# EAGLE board Interface v1_6 (EAGLE 7.7.0), part 1 of 2
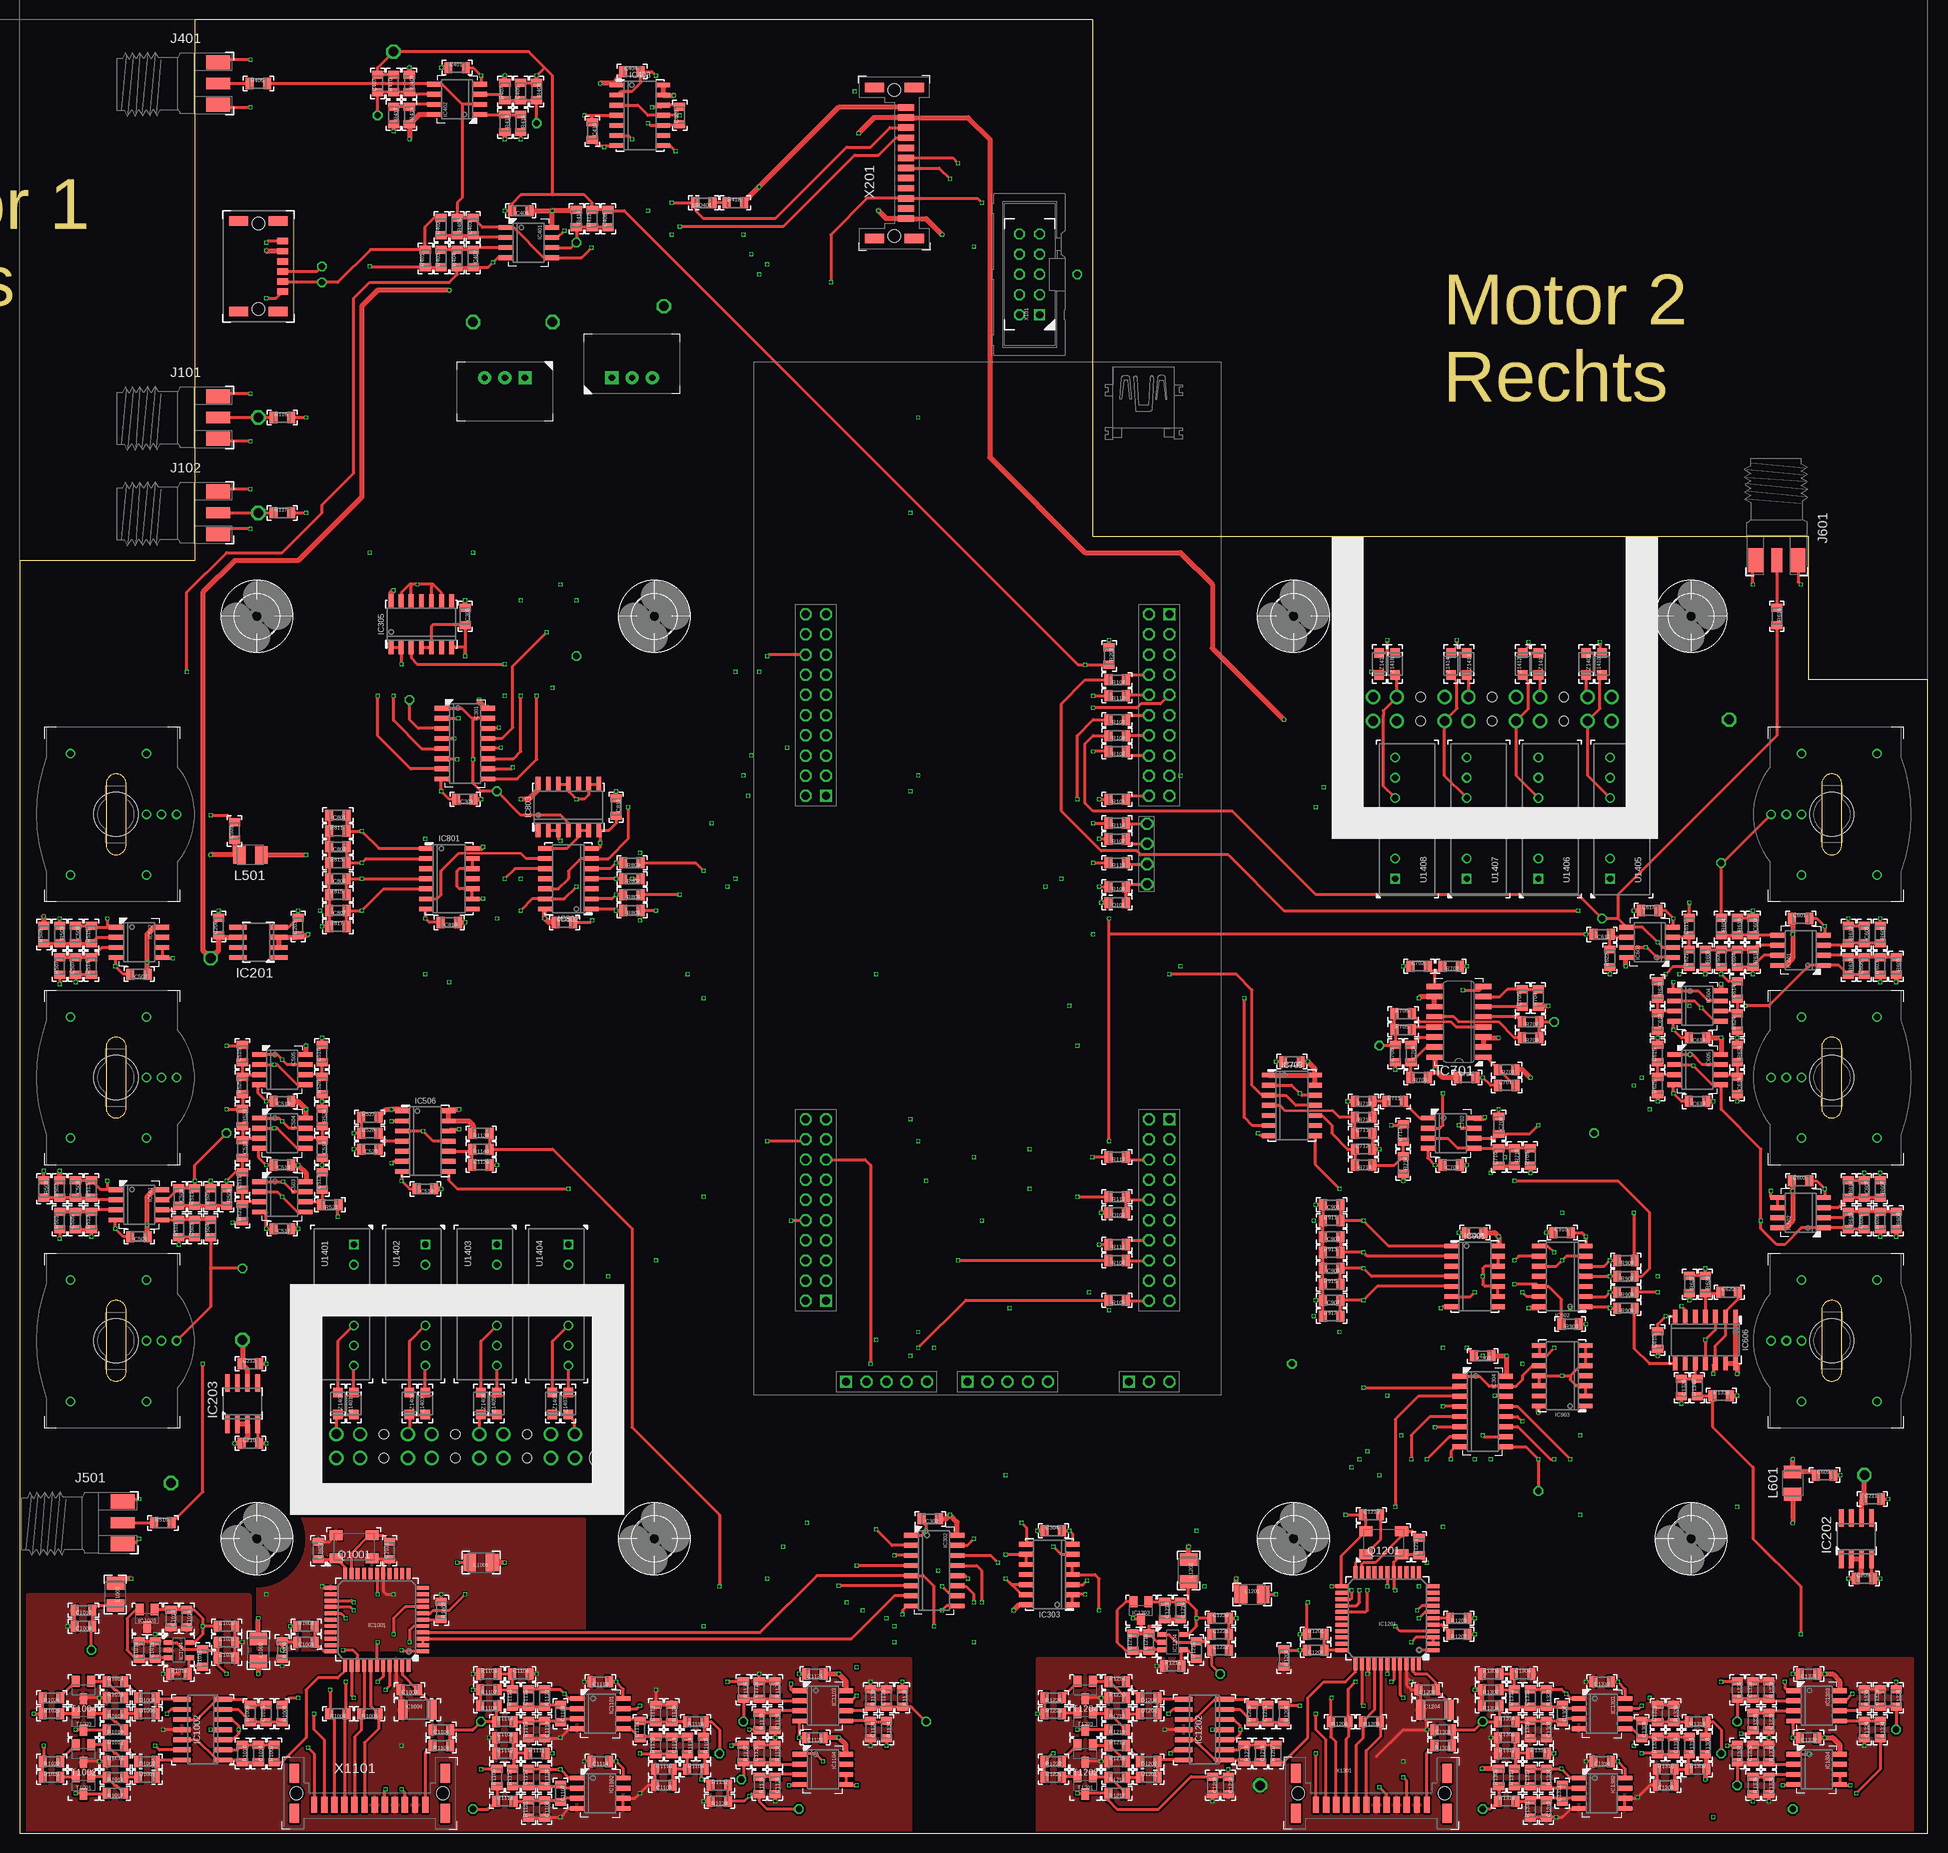
[diagram p22: board, top side]
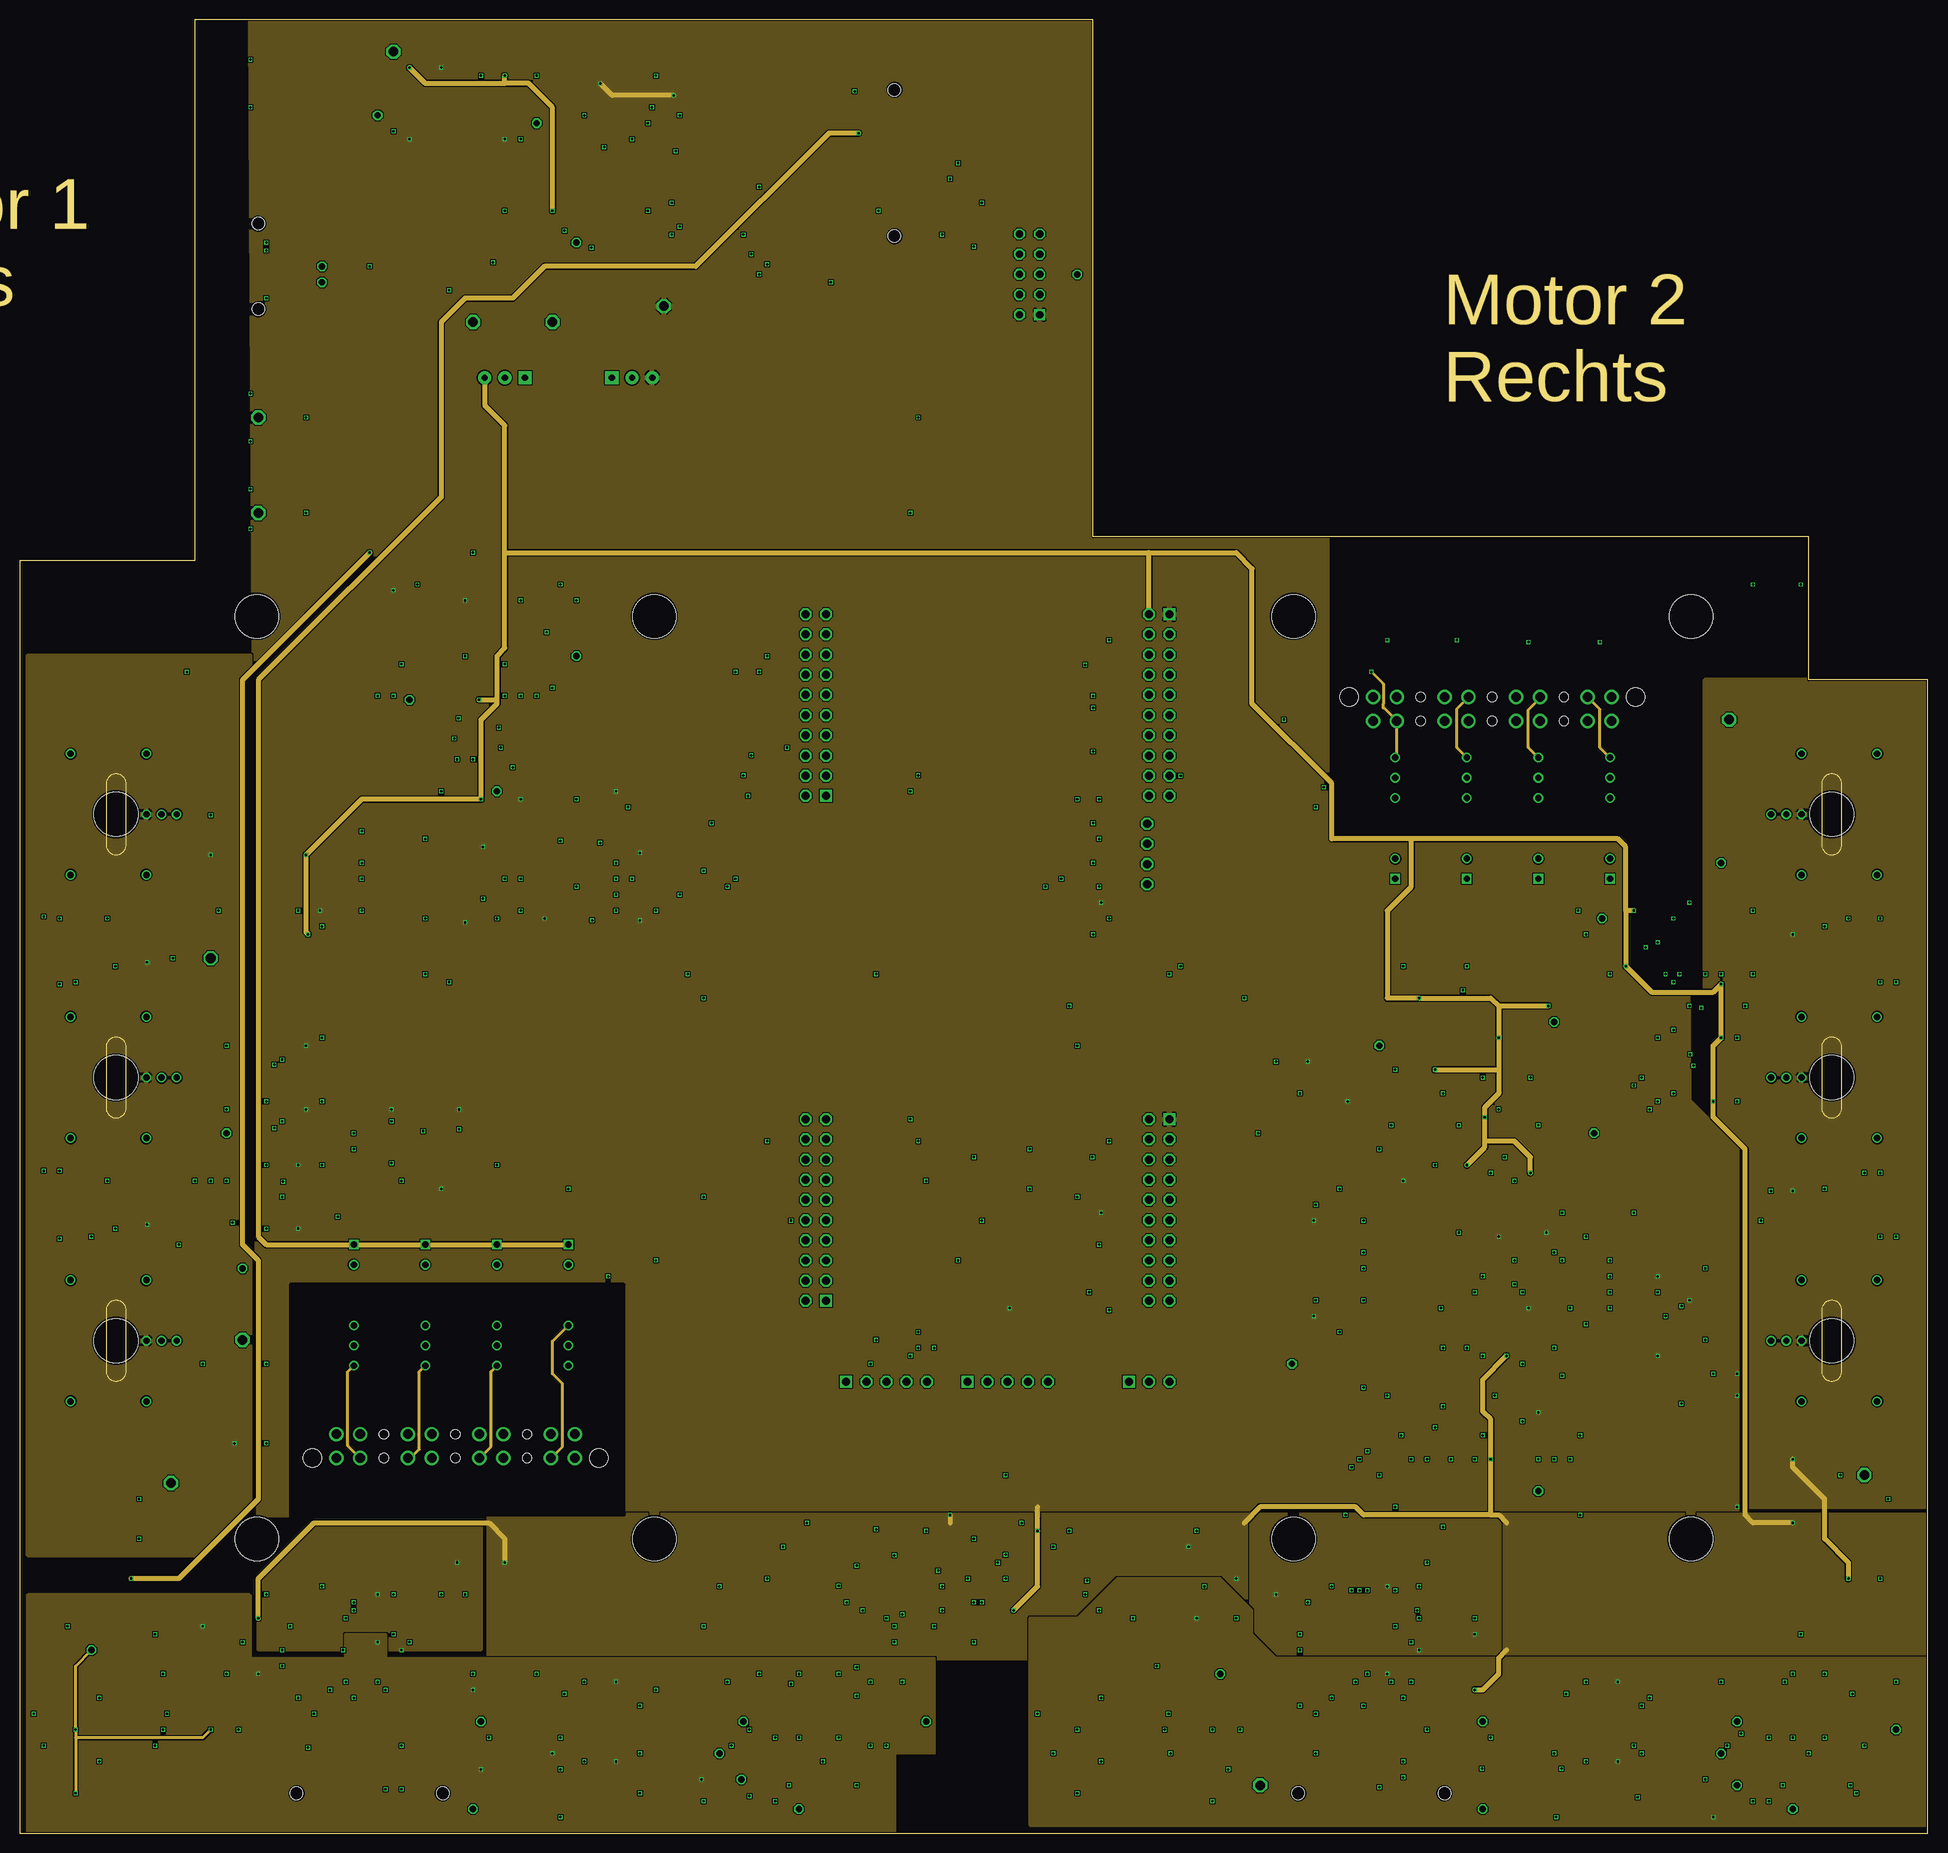
[diagram p23: board, inner layer VDD]
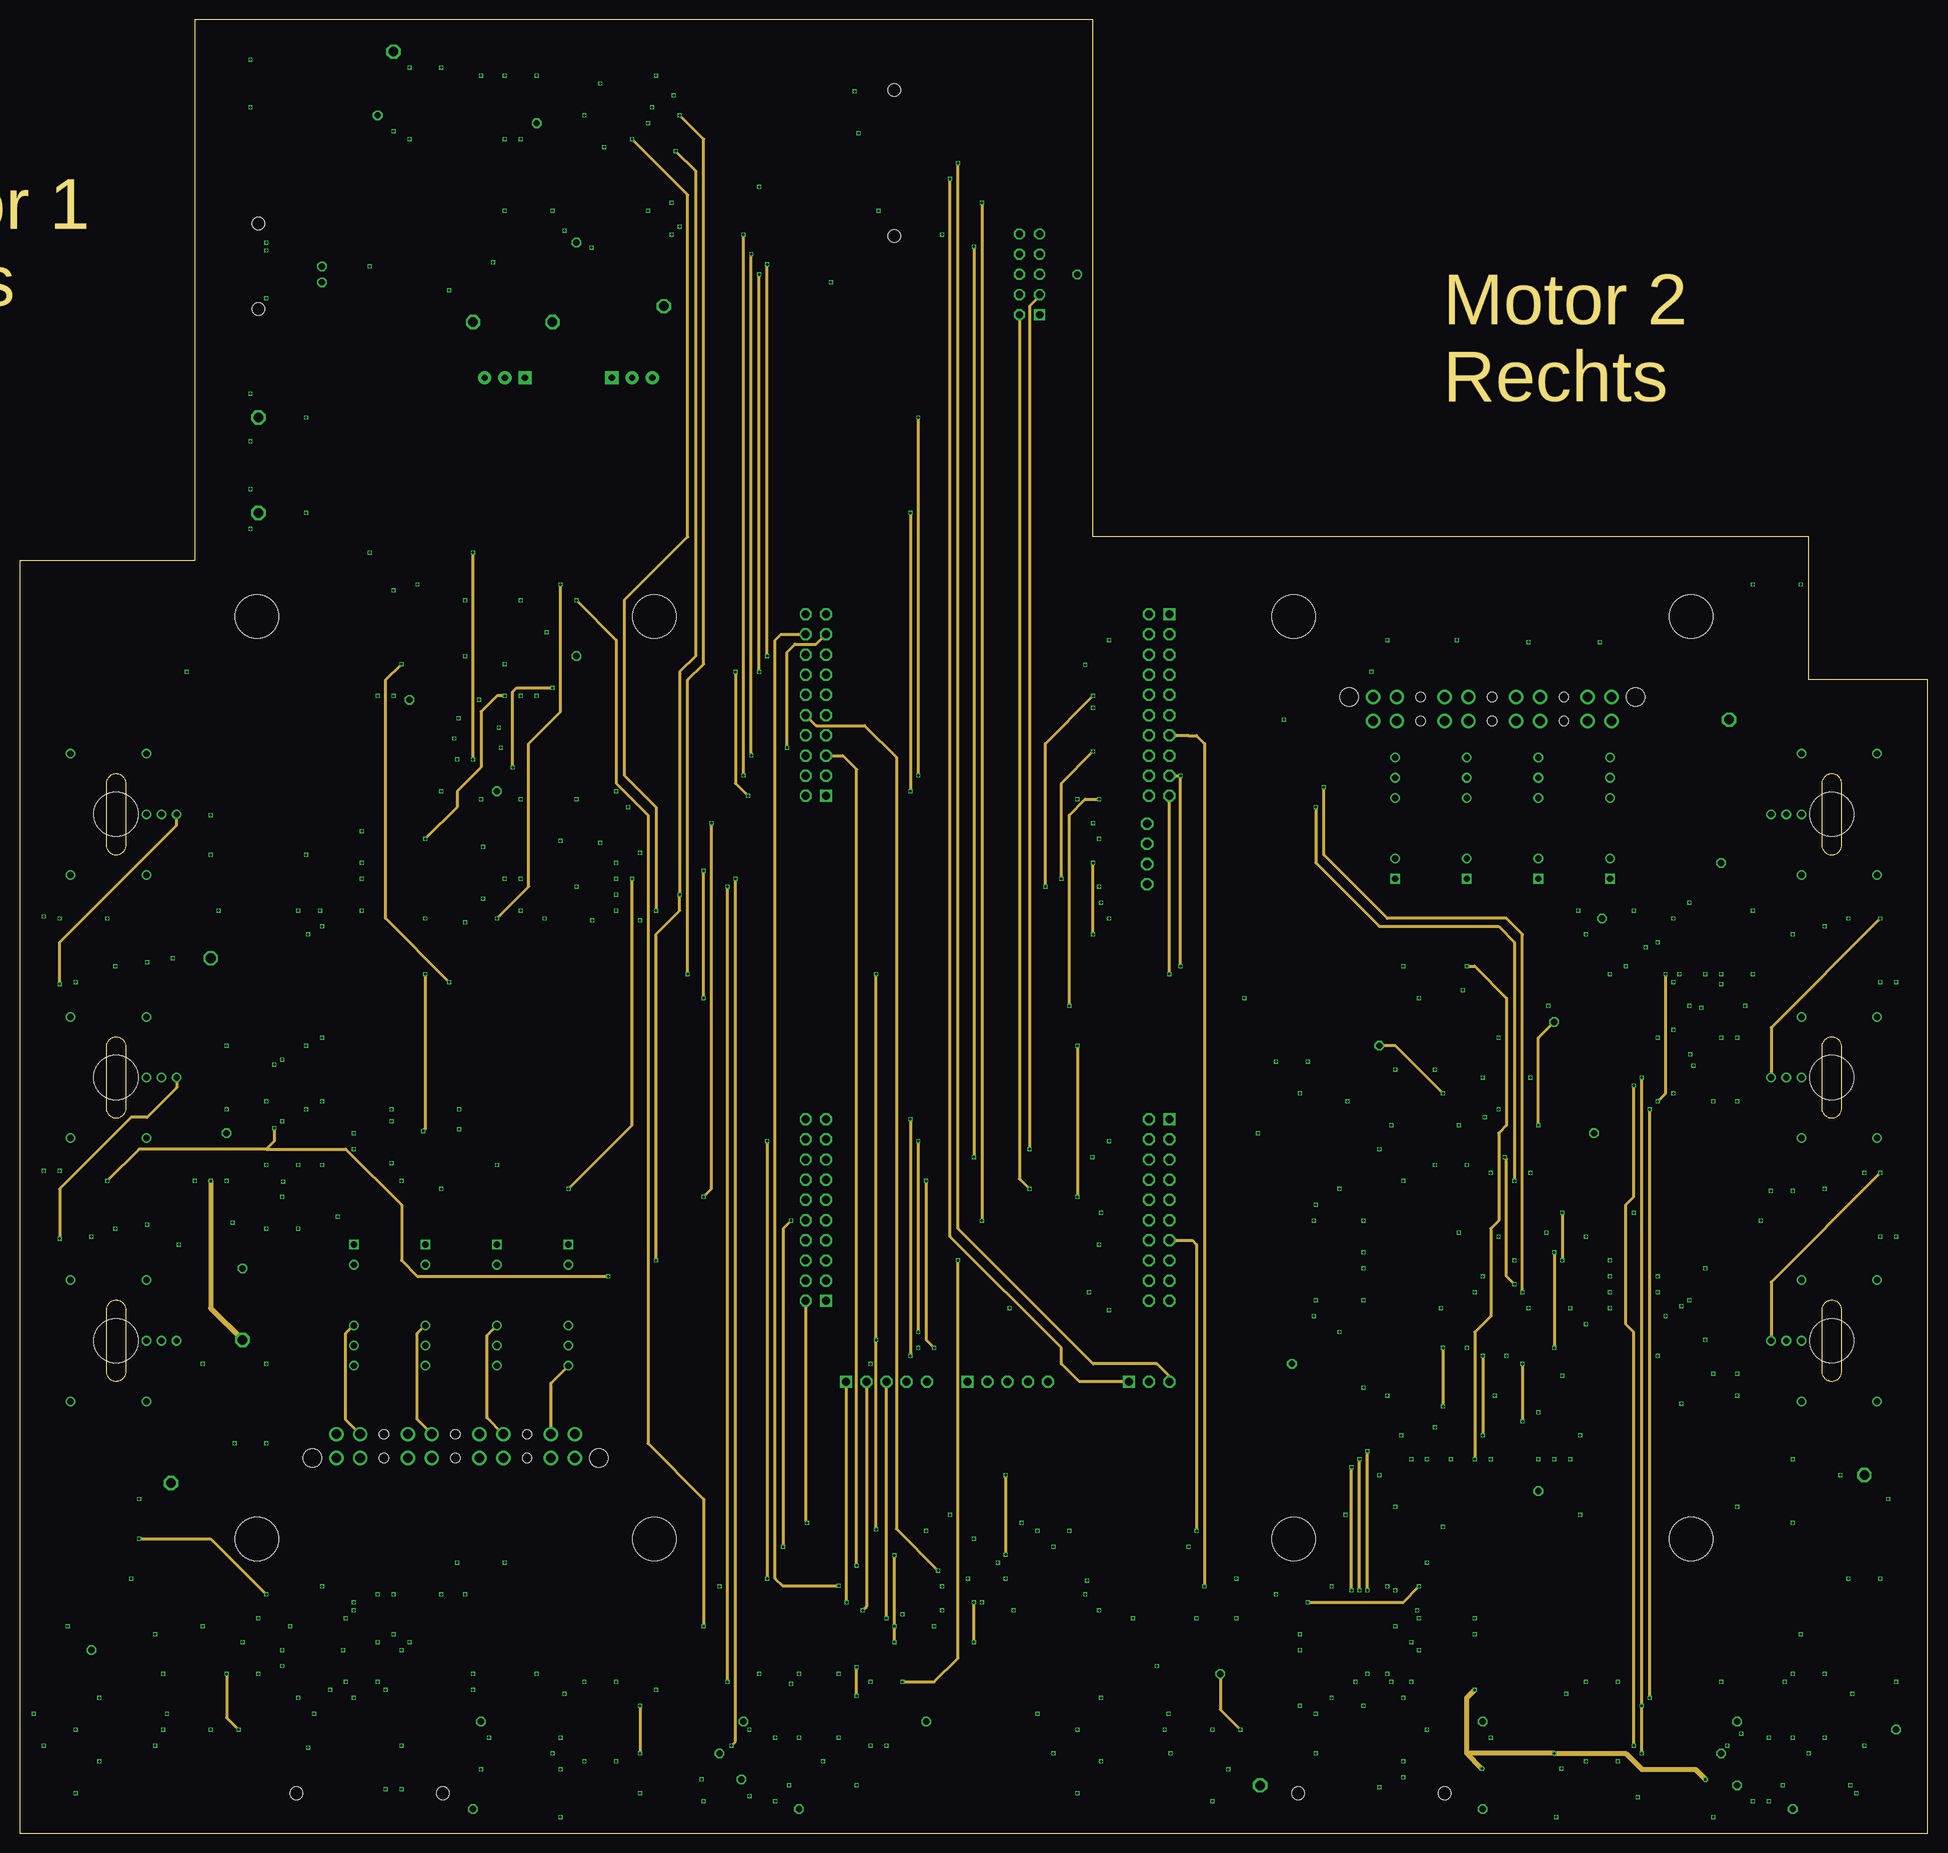
[diagram p24: board, inner layer Route3]
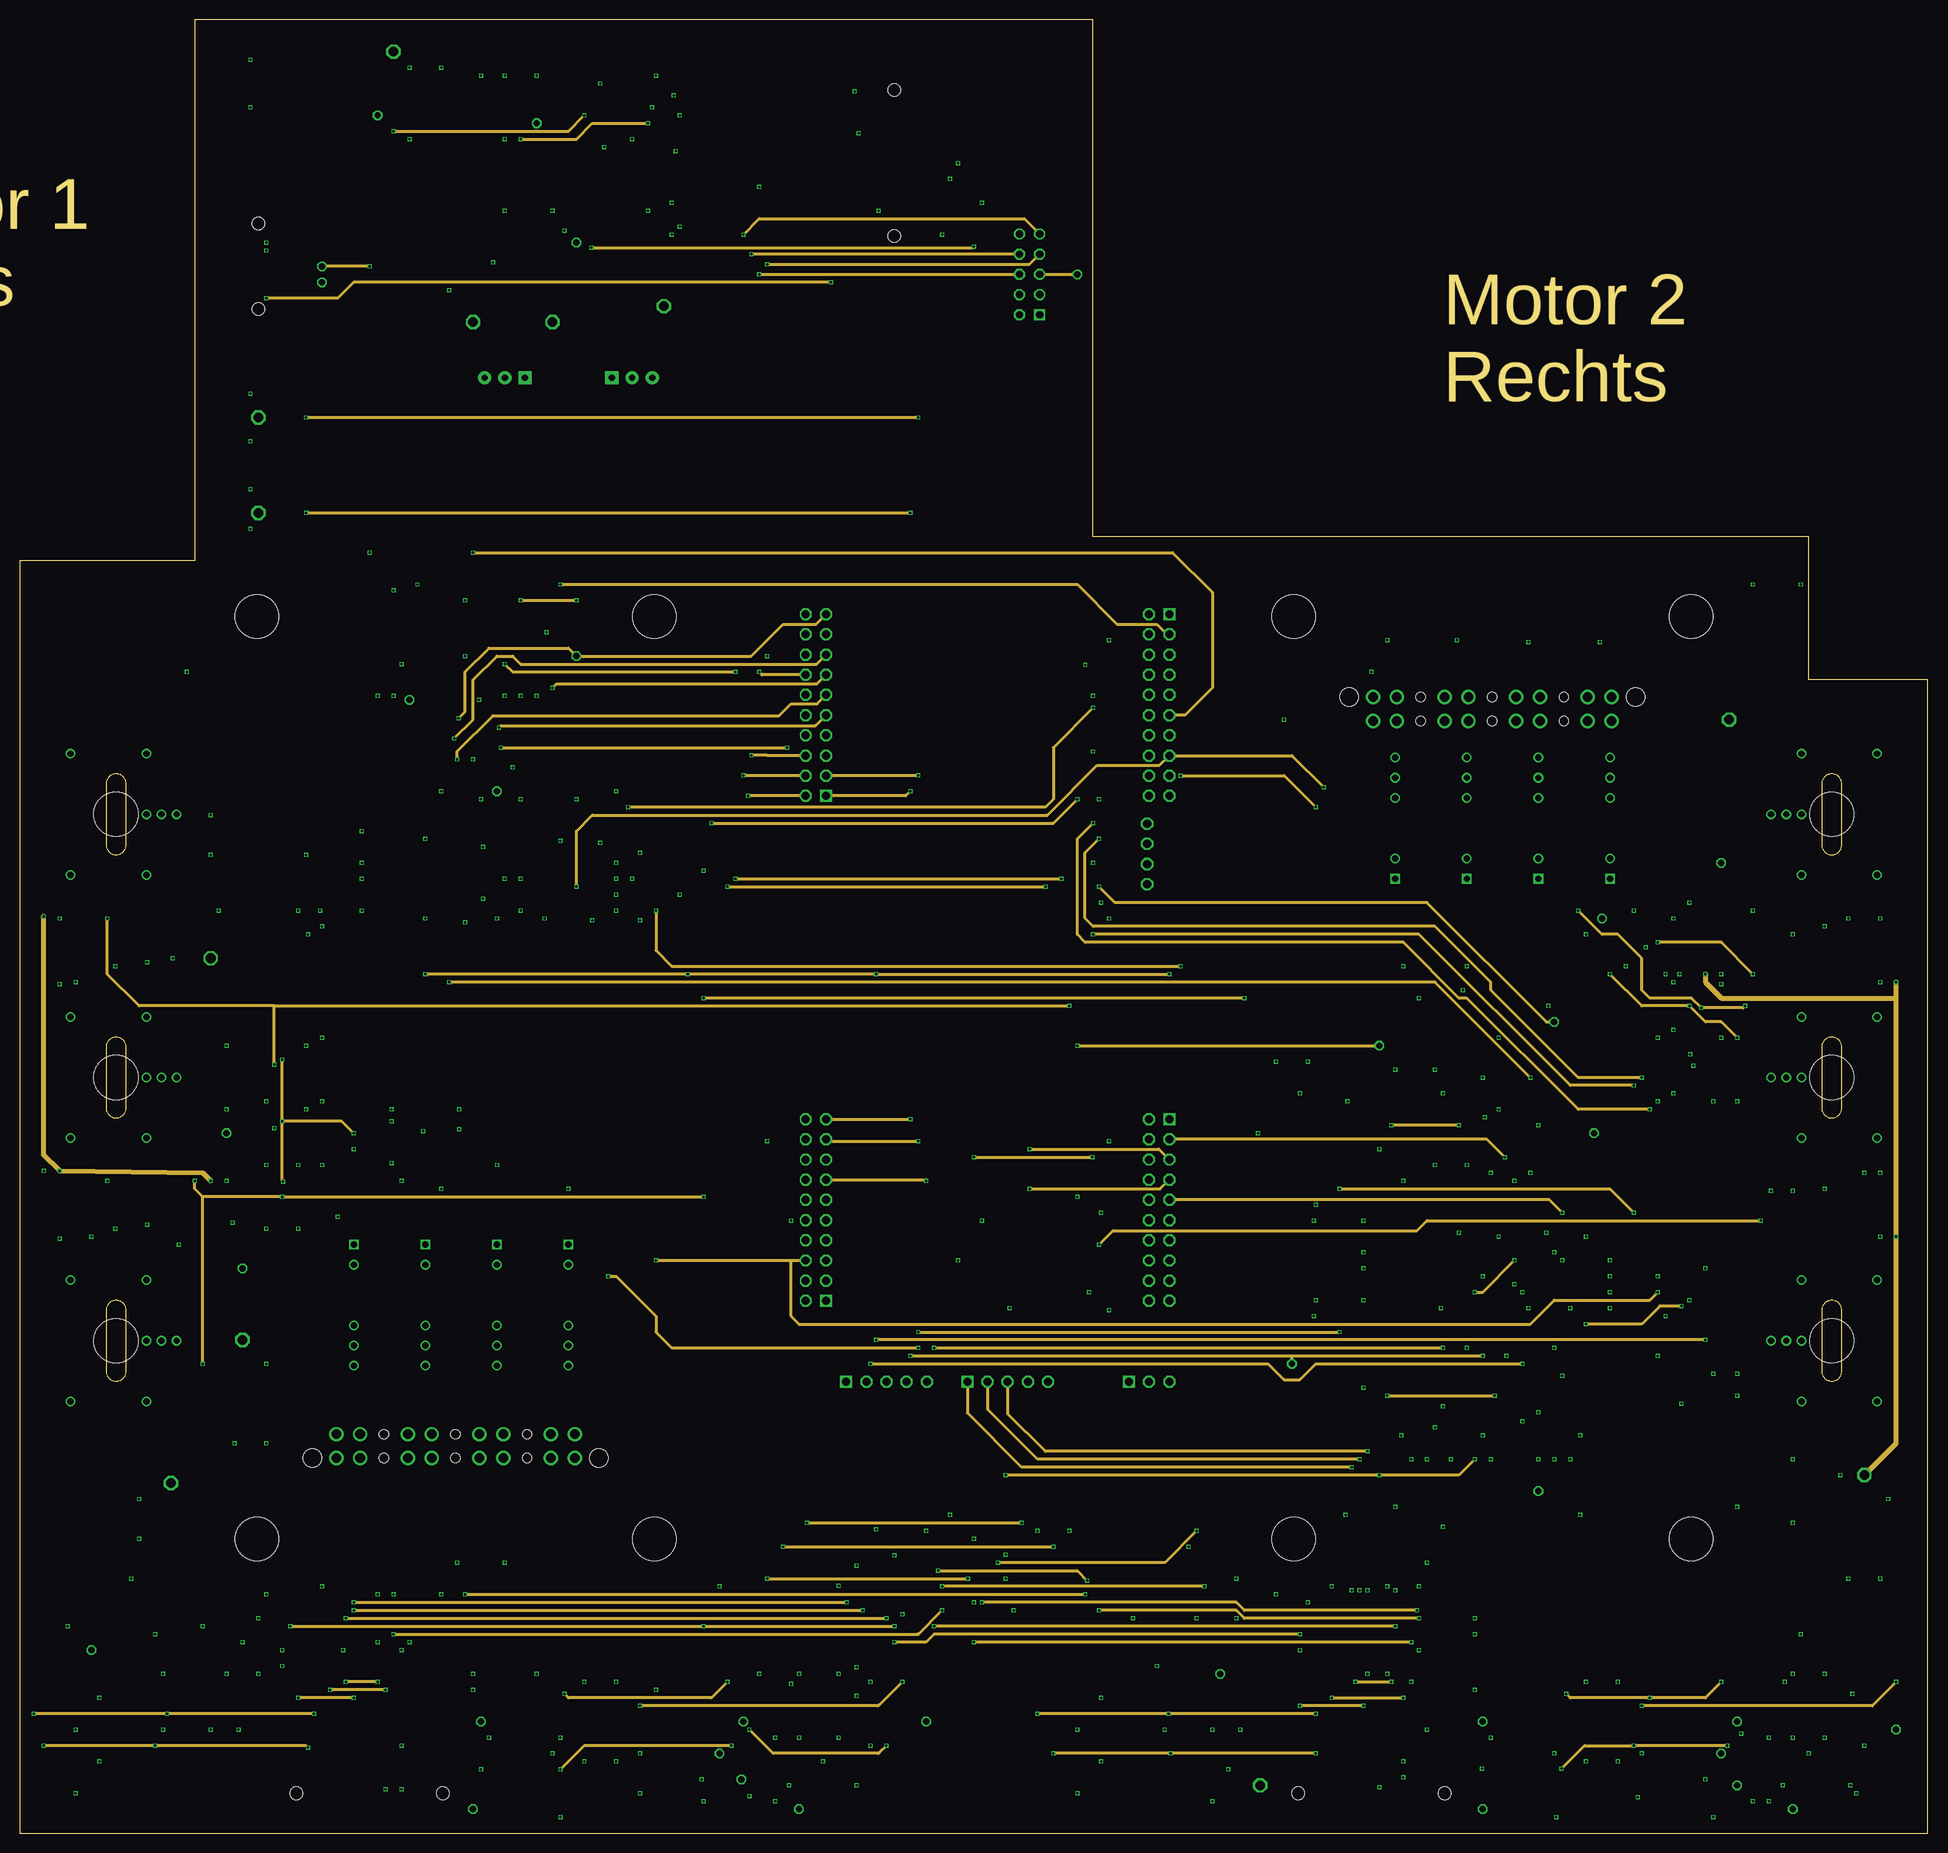
[diagram p25: board, inner layer Route4]
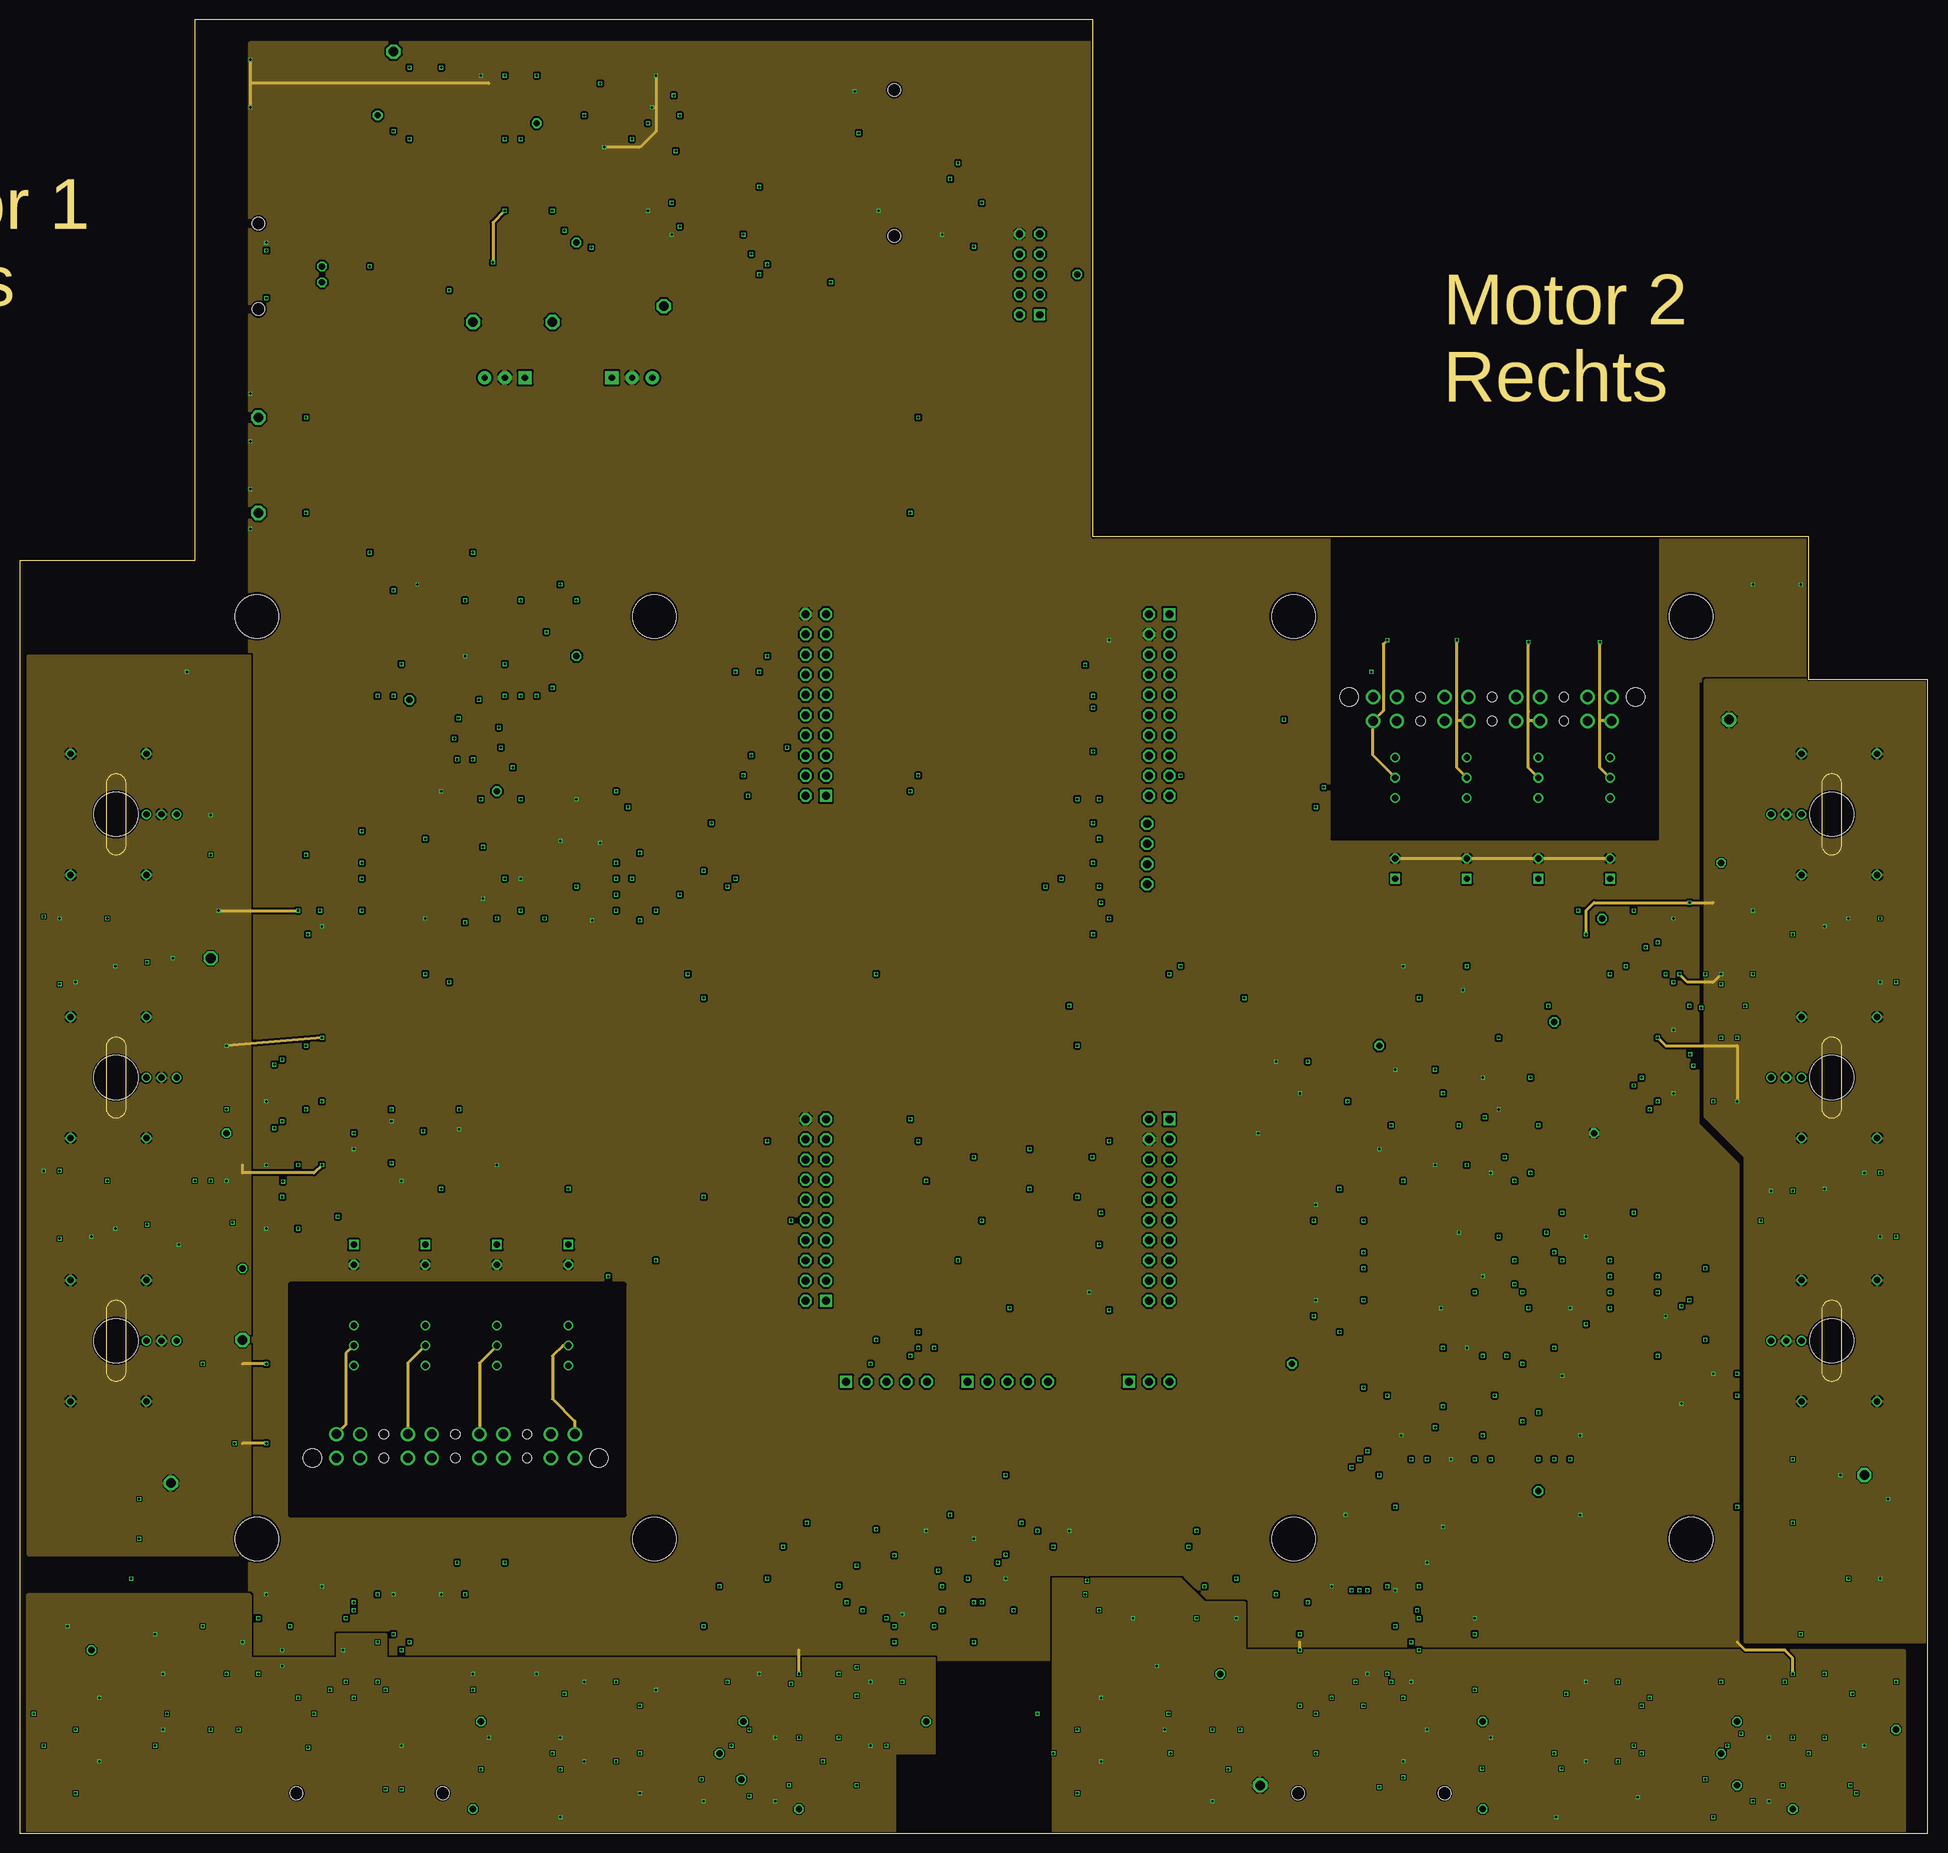
[diagram p26: board, inner layer GND]
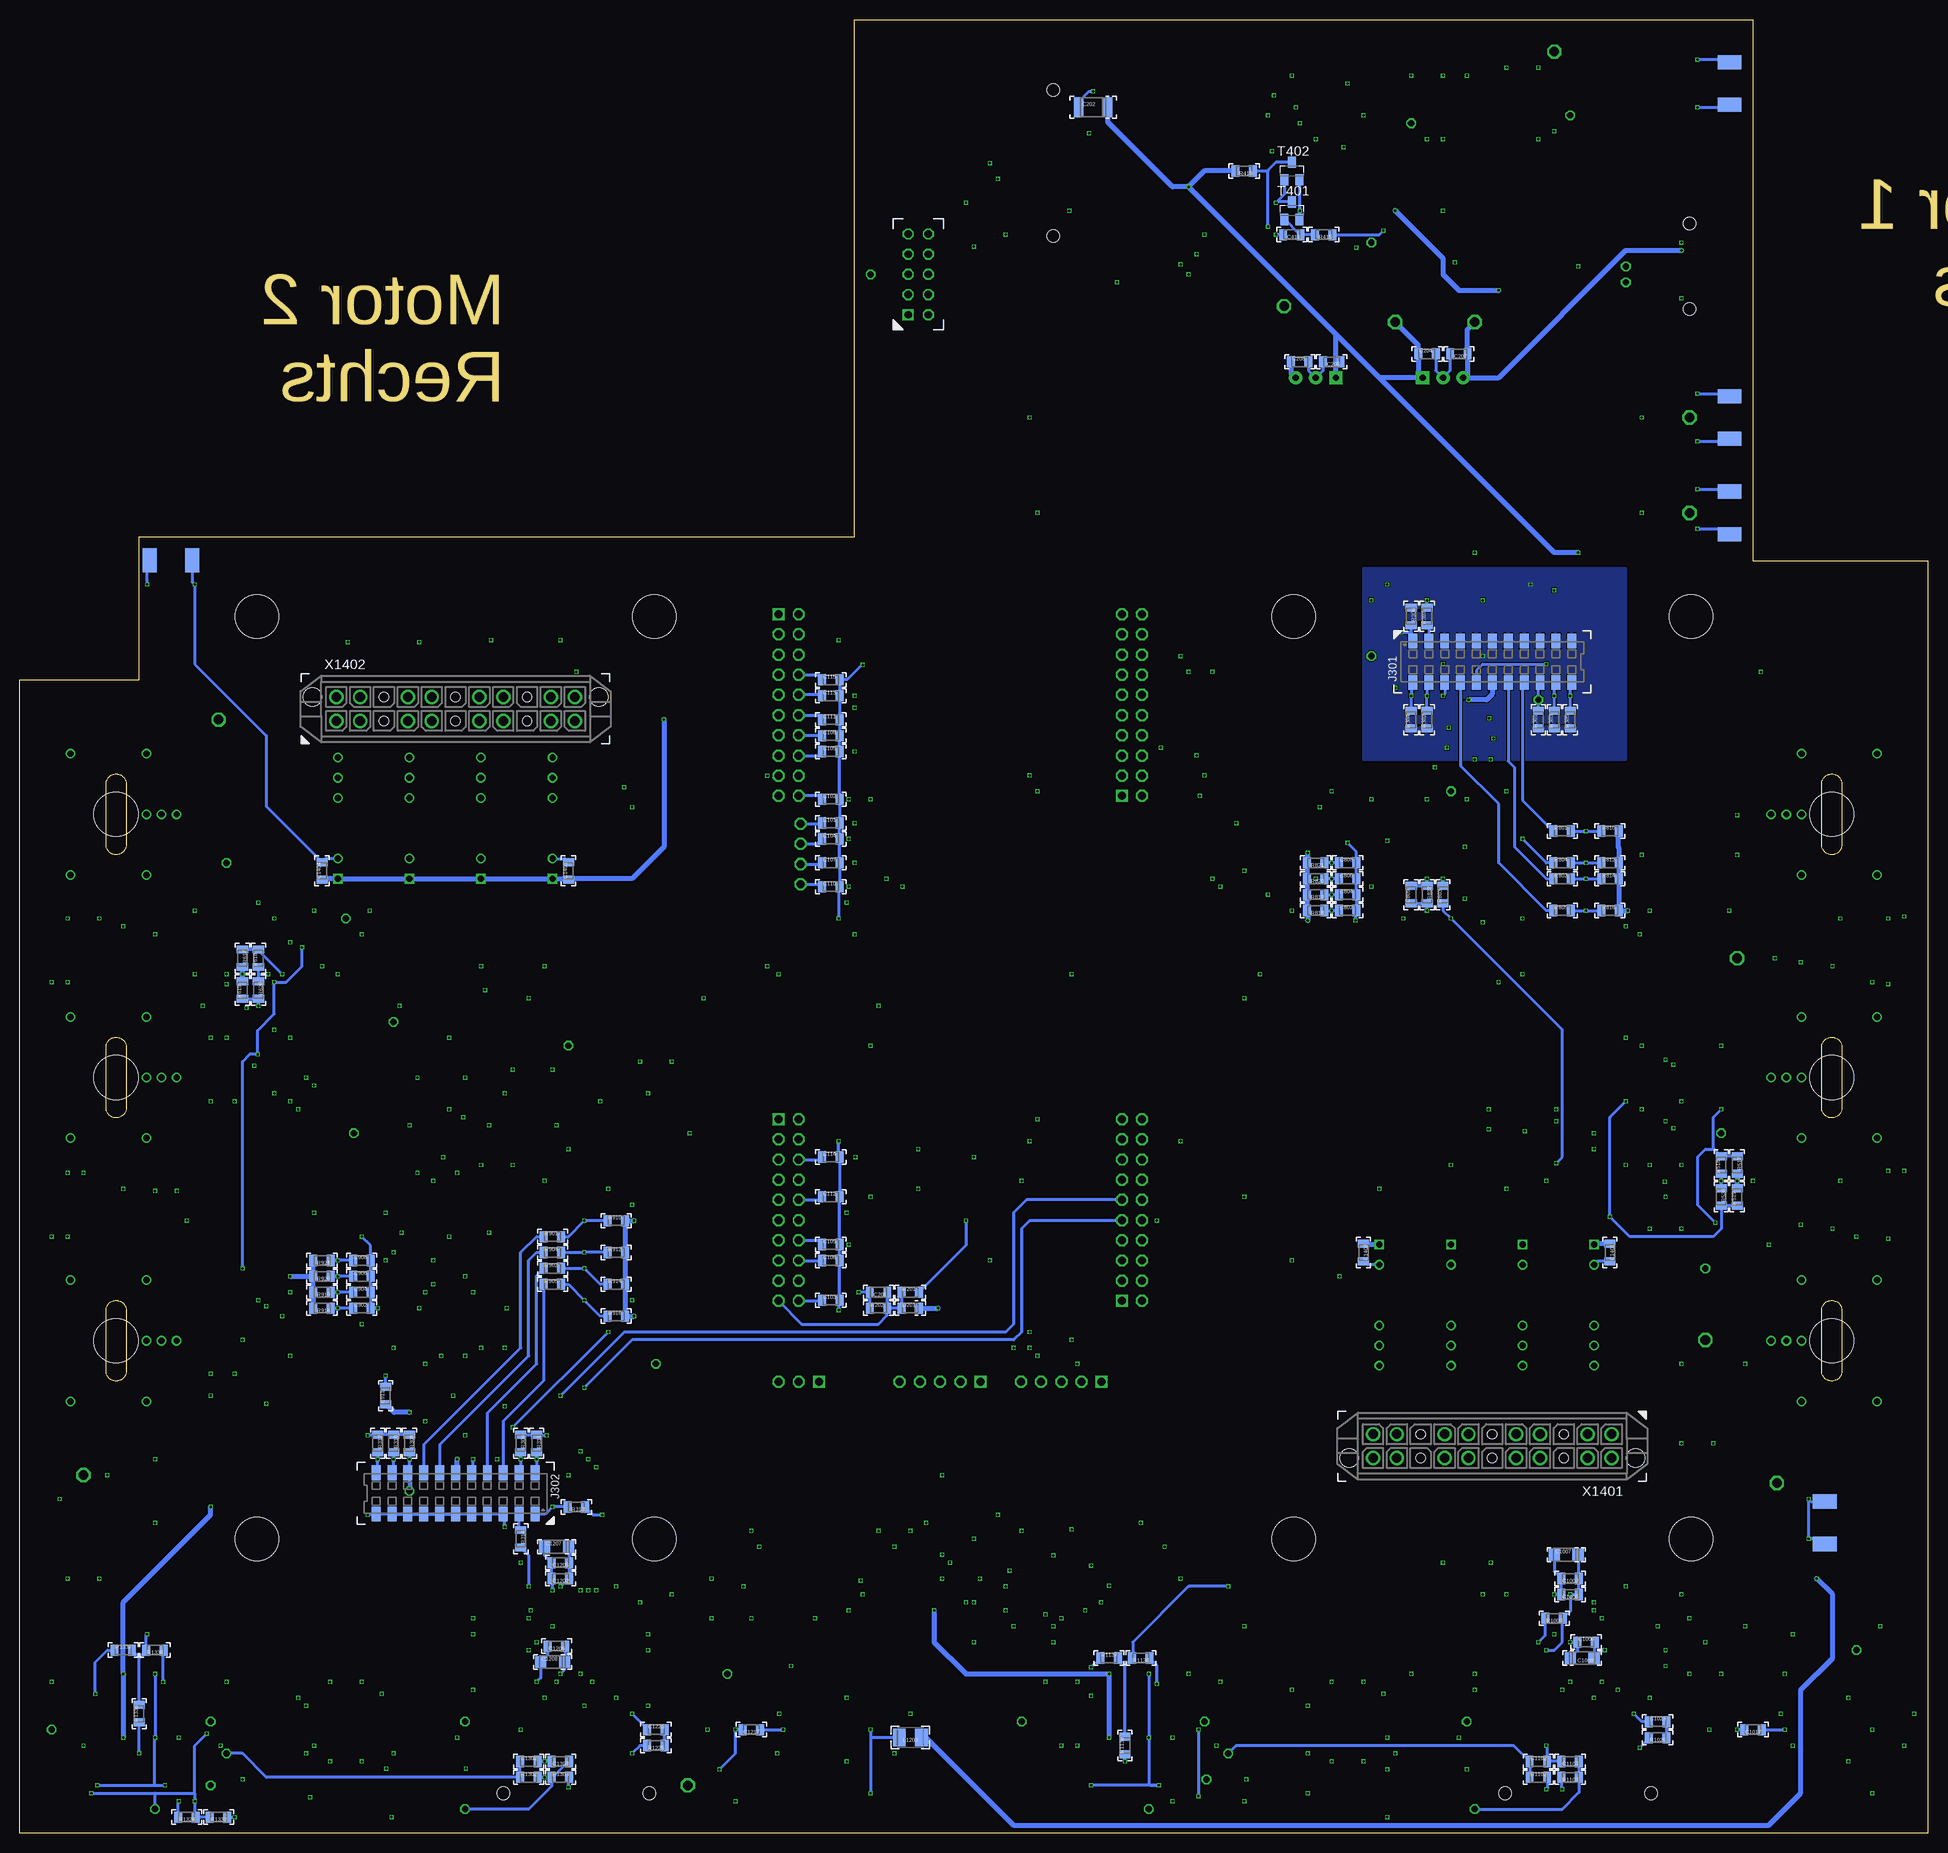
[diagram p27: board, bottom side, seen from below]

Size 240 x 228 mm. Coordinates in mm from the lower left corner, seen from the top.
Outline: 0,0 240,0 240,145 225,145 225,163 135,163 135,228 22,228 22,160 0,160 0,0
Copper layers (1+2*3+4*5+16): Top 0.018mm / dielectric 0.2mm / VDD 0.035mm / dielectric 0.36mm / Route3 0.035mm / dielectric 0.3mm / Route4 0.035mm / dielectric 0.36mm / GND 0.035mm / dielectric 0.2mm / Bottom 0.018mm
Design rules "Multi-CB_6L_100um-Tracks_OL35um-IL35um": minimum track width 0.1mm, minimum drill 0.2mm, track to track 0.1mm, track to pad 0.1mm, pad to pad 0.1mm, via to via 0.1mm, smd to smd 0mil, copper to edge 0.2mm, drill to drill 0.2mm, minimum pad ring 0.1mm, minimum via ring 0.1mm, stop-mask expansion 2mil, vias tented up to drill 0.45mm, thermal gap 0.2mm
Net classes: 0 default: width 0.152 mm, drill 0.203 mm, clearance 0.152 mm; 1 HV_UT: clearance 4 mm to class 0, clearance 0.15 mm; 2 HV_VT: clearance 4 mm to class 0, clearance 4 mm to class 1, clearance 0.15 mm; 3 HV_WT: clearance 4 mm to class 0, clearance 4 mm to class 1, clearance 4 mm to class 2, clearance 0.15 mm; 4 HV_1B: clearance 4 mm to class 0, clearance 4 mm to class 1, clearance 4 mm to class 2, clearance 4 mm to class 3, clearance 0.15 mm; 5 VDD: width 0.61 mm, clearance 0.152 mm to class 0, clearance 4 mm to class 1, clearance 4 mm to class 2, clearance 4 mm to class 3, clearance 4 mm to class 4, clearance 0.152 mm

## Footprints (pad centres in the part's own frame; a part is rotated, then mirrored left to right if it is on the bottom)
C-0805" = smd 1 x 1.4: 1 -1.1,0; 2 1.1,0
CP-1210" = smd 1.2 x 2.5: + 1.8,0; - -1.8,0
CP-1206" = smd 1.4 x 1.5: + 1.5,0; - -1.5,0
D-0805" = smd 1 x 1.4: A -1.1,0; C 1.1,0
TSR-1 = drill 0.8 pad 1.676 square: 1 -2.54,0 | drill 0.8 pad 1.676: 2 0,0; 3 2.54,0
5,5 = hole 5.5: 0,0
HC2F = drill 0.8: 1 0,-7.62; 2 0,-5.715; 3 0,-3.81; E1 7.62,-3.81; E2 -7.62,-3.81; E3 -7.62,5.715; E4 7.62,5.715 | hole 5.6: 0,0
SO8 = smd 0.6 x 2.2: 1 -1.905,-2.6; 2 -0.635,-2.6; 3 0.635,-2.6; 4 1.905,-2.6; 5 1.905,2.6; 6 0.635,2.6; 7 -0.635,2.6; 8 -1.905,2.6
SOIC16 = smd 0.6 x 1.8: 1 -4.445,-2.9; 2 -3.175,-2.9; 3 -1.905,-2.9; 4 -0.635,-2.9; 5 0.635,-2.9; 6 1.905,-2.9; 7 3.175,-2.9; 8 4.445,-2.9; 9 4.445,2.9; 10 3.175,2.9; 11 1.905,2.9; 12 0.635,2.9; 13 -0.635,2.9; 14 -1.905,2.9; 15 -3.175,2.9; 16 -4.445,2.9
SOIC14 = smd 0.6 x 1.8: 1 -3.81,-2.9; 2 -2.54,-2.9; 3 -1.27,-2.9; 4 0,-2.9; 5 1.27,-2.9; 6 2.54,-2.9; 7 3.81,-2.9; 8 3.81,2.9; 9 2.54,2.9; 10 1.27,2.9; 11 0,2.9; 12 -1.27,2.9; 13 -2.54,2.9; 14 -3.81,2.9
SOIC8 = smd 0.6 x 1.8: 1 -1.905,-2.9; 2 -0.635,-2.9; 3 0.635,-2.9; 4 1.905,-2.9; 5 1.905,2.9; 6 0.635,2.9; 7 -0.635,2.9; 8 -1.905,2.9
SO16 = smd 0.66 x 2.032: 1 -4.445,-3.073; 2 -3.175,-3.073; 3 -1.905,-3.073; 4 -0.635,-3.073; 5 0.635,-3.073; 6 1.905,-3.073; 7 3.175,-3.073; 8 4.445,-3.073; 9 4.445,3.073; 10 3.175,3.073; 11 1.905,3.073; 12 0.635,3.073; 13 -0.635,3.073; 14 -1.905,3.073; 15 -3.175,3.073; 16 -4.445,3.073
TQFP44 = smd 1.5 x 0.5: 1 -5.8,4; 2 -5.8,3.2; 3 -5.8,2.4; 4 -5.8,1.6; 5 -5.8,0.8; 6 -5.8,0; 7 -5.8,-0.8; 8 -5.8,-1.6; 9 -5.8,-2.4; 10 -5.8,-3.2; 11 -5.8,-4; 23 5.8,-4; 24 5.8,-3.2; 25 5.8,-2.4; 26 5.8,-1.6; 27 5.8,-0.8; 28 5.8,0; 29 5.8,0.8; 30 5.8,1.6; 31 5.8,2.4; 32 5.8,3.2; 33 5.8,4 | smd 0.5 x 1.5: 12 -4,-5.8; 13 -3.2,-5.8; 14 -2.4,-5.8; 15 -1.6,-5.8; 16 -0.8,-5.8; 17 0,-5.8; 18 0.8,-5.8; 19 1.6,-5.8; 20 2.4,-5.8; 21 3.2,-5.8; 22 4,-5.8; 34 4,5.8; 35 3.2,5.8; 36 2.4,5.8; 37 1.6,5.8; 38 0.8,5.8; 39 0,5.8; 40 -0.8,5.8; 41 -1.6,5.8; 42 -2.4,5.8; 43 -3.2,5.8; 44 -4,5.8
SO14 = smd 0.6 x 2.2: 1 -3.81,-2.6; 2 -2.54,-2.6; 3 -1.27,-2.6; 4 0,-2.6; 5 1.27,-2.6; 6 2.54,-2.6; 7 3.81,-2.6; 8 3.81,2.6; 9 2.54,2.6; 10 1.27,2.6; 11 0,2.6; 12 -1.27,2.6; 13 -2.54,2.6; 14 -3.81,2.6
SOT23 = smd 1 x 1.4: 1 -0.95,-1.1; 2 0.95,-1.1; 3 0,1.1
SOT23-5 = smd 0.6 x 1.2: 1 -0.95,-1.306; 2 0,-1.306; 3 0.95,-1.306; 4 0.95,1.306; 5 -0.95,1.306
SMA_KLEIN = smd 3 x 1.8 bottom: 1 2.954,2.675; 3 2.954,-2.675 | smd 3 x 1.8: 4 2.954,-2.675; 5 2.954,2.675 | smd 3 x 1.4: SIG 2.954,0
79109-22 = smd 1.12 x 1.83: 1 -10,2.6; 2 -10,-2.6; 3 -8,2.6; 4 -8,-2.6; 5 -6,2.6; 6 -6,-2.6; 7 -4,2.6; 8 -4,-2.6; 9 -2,2.6; 10 -2,-2.6; 11 0,2.6; 12 0,-2.6; 13 2,2.6; 14 2,-2.6; 15 4,2.6; 16 4,-2.6; 17 6,2.6; 18 6,-2.6; 19 8,2.6; 20 8,-2.6; 21 10,2.6; 22 10,-2.6
L3230M = smd 1.6 x 2.2: 1 -1.4,0; 2 1.4,0
L-1206 = smd 1.6 x 2.2: 1 -1.4,0; 2 1.4,0
LED-0805" = smd 1 x 1.4: A -1.1,0; C 1.1,0
LAUNCHPAD_M = drill 1 square: 1 -31.73,3.43; 31 -54.59,46.61; 41 -95.23,3.43; 71 -118.09,46.61; 81 -128.25,28.83; 86 -128.25,44.07; CANH -128.25,8.51 | drill 1 octagon: 2 -34.27,3.43; 3 -36.81,3.43; 4 -39.35,3.43; 5 -41.89,3.43; 6 -44.43,3.43; 7 -46.97,3.43; 8 -49.51,3.43; 9 -52.05,3.43; 10 -54.59,3.43; 11 -54.59,49.15; 12 -52.05,49.15; 13 -49.51,49.15; 14 -46.97,49.15; 15 -44.43,49.15; 16 -41.89,49.15; 17 -39.35,49.15; 18 -36.81,49.15; 19 -34.27,49.15; 20 -31.73,49.15; 21 -31.73,5.97; 22 -34.27,5.97; 23 -36.81,5.97; 24 -39.35,5.97; 25 -41.89,5.97; 26 -44.43,5.97; 27 -46.97,5.97; 28 -49.51,5.97; 29 -52.05,5.97; 30 -54.59,5.97; 32 -52.05,46.61; 33 -49.51,46.61; 34 -46.97,46.61; 35 -44.43,46.61; 36 -41.89,46.61; 37 -39.35,46.61; 38 -36.81,46.61; 39 -34.27,46.61; 40 -31.73,46.61; 42 -97.77,3.43; 43 -100.31,3.43; 44 -102.85,3.43; 45 -105.39,3.43; 46 -107.93,3.43; 47 -110.47,3.43; 48 -113.01,3.43; 49 -115.55,3.43; 50 -118.09,3.43; 51 -118.09,49.15; 52 -115.55,49.15; 53 -113.01,49.15; 54 -110.47,49.15; 55 -107.93,49.15; 56 -105.39,49.15; 57 -102.85,49.15; 58 -100.31,49.15; 59 -97.77,49.15; 60 -95.23,49.15; 61 -95.23,5.97; 62 -97.77,5.97; 63 -100.31,5.97; 64 -102.85,5.97; 65 -105.39,5.97; 66 -107.93,5.97; 67 -110.47,5.97; 68 -113.01,5.97; 69 -115.55,5.97; 70 -118.09,5.97; 72 -115.55,46.61; 73 -113.01,46.61; 74 -110.47,46.61; 75 -107.93,46.61; 76 -105.39,46.61; 77 -102.85,46.61; 78 -100.31,46.61; 79 -97.77,46.61; 80 -95.23,46.61; 82 -128.25,26.29; 83 -128.25,23.75; 84 -128.25,21.21; 85 -128.25,18.67; 87 -128.25,41.53; 88 -128.25,38.99; 89 -128.25,36.45; 90 -128.25,33.91; CANGND -128.25,3.43; CANL -128.25,5.97 | drill 1.016 octagon: 91 -58.074,6.204; 92 -60.614,6.204; 93 -63.154,6.204; 94 -65.694,6.204
CRYSTAL3.2X5 = smd 1.65 x 1.3: 1 -2.2,-1.45; 2 2.3,-1.45; 3 2.3,1.45; 4 -2.2,1.45
R-0805" = smd 1 x 1.4: 1 -1.1,0; 2 1.1,0
SOT23-BEC = smd 1 x 1.4: B -0.95,-1.1; C 0,1.1; E 0.95,-1.1
TP-08 = drill 0.8 octagon: TP 0,0
TP-12 = drill 1.2 octagon: TP 0,0
TMV2 = drill 0.8 square: 1 0,0 | drill 0.8: 2 2.54,0; 5 10.16,0; 6 12.7,0; 7 15.24,0
ML-2~10 = drill 0.914 square: 1 -5.08,-1.27 | drill 0.914 octagon: 2 -5.08,1.27; 3 -2.54,-1.27; 4 -2.54,1.27; 5 0,-1.27; 6 0,1.27; 7 2.54,-1.27; 8 2.54,1.27; 9 5.08,-1.27; 10 5.08,1.27
MINIBRIDGE12-GERADE = smd 0.8 x 2: 1 6.985,-1.45; 2 5.715,-1.45; 3 4.445,-1.45; 4 3.175,-1.45; 5 1.905,-1.45; 6 0.635,-1.45; 7 -0.635,-1.45; 8 -1.905,-1.45; 9 -3.175,-1.45; 10 -4.445,-1.45; 11 -5.715,-1.45; 12 -6.985,-1.45 | smd 1.2 x 2.4: P$1 -9.495,-2.5; P$3 -9.495,2.5; P$4 9.495,2.5; P$5 9.495,-2.5 | hole 1.6: 9.195,0; -9.195,0
MINIBRIDGE6-ABGEWINKELT = smd 0.8 x 1.4: 1 3.175,3.05; 2 1.905,3.05; 3 0.635,3.05; 4 -0.635,3.05; 5 -1.905,3.05; 6 -3.175,3.05 | smd 1.2 x 2.4: P$1 -5.685,-2.5; P$3 -5.685,2.5; P$4 5.685,2.5; P$5 5.685,-2.5 | hole 1.6: -5.385,0; 5.385,0
44769-2201_EUGEN = drill 1.2: P1 -15,-2; P2 -15,1; P3 -12,-2; P4 -12,1; P7 -6,-2; P8 -6,1; P9 -3,-2; P10 -3,1; P13 3,-2; P14 3,1; P15 6,-2; P16 6,1; P19 12,-2; P20 12,1; P21 15,-2; P22 15,1 | hole 2.36: 18,1; -18,1 | hole 1.2: -9,1; -9,-2; 0,1; 0,-2; 9,1; 9,-2
D-SOD123W = smd 1.2 x 1.2: A -1.4,0; C 1.4,0

## Placement (x,y rotation side)
C101  NB  [C-0805"]  138,127 0 bottom
C102  NB  [C-0805"]  138,130 0 bottom
C103  NB  [C-0805"]  138,67 0 bottom
C104  NB  [C-0805"]  138,125 0 bottom
C105  NB  [C-0805"]  138,136 0 bottom
C106  NB  [C-0805"]  138,72 0 bottom
C107  NB  [C-0805"]  138,122 0 bottom
C108  NB  [C-0805"]  138,138 0 bottom
C109  NB  [C-0805"]  138,74 0 bottom
C110  NB  [C-0805"]  138,119 0 bottom
C111  NB  [C-0805"]  138,140 0 bottom
C112  NB  [C-0805"]  138,80 0 bottom
C113  NB  [C-0805"]  138,143 0 bottom
C114  NB  [C-0805"]  138,85 0 bottom
C115  NB  [C-0805"]  138,145 0 bottom
C201  NB  [C-0805"]  132,68 180 bottom
C202  NB  [CP-1210"]  105,217 0 bottom
C203  1µF  [C-0805"]  35,114 90 top
C204  NB  [C-0805"]  63,186 0 bottom
C205  NB  [C-0805"]  75,185 180 bottom
C206  2µ2  [C-0805"]  25,114 90 top
C207  NB  [C-0805"]  59,186 180 bottom
C208  NB  [C-0805"]  79,185 0 bottom
C209  1µF  [C-0805"]  232,32 0 top
C210  1µF  [C-0805"]  29,49 0 top
C211  2µ2  [C-0805"]  233,42 0 top
C212  2µ2  [C-0805"]  29,59 0 top
C301  100nF  [C-0805"]  56,130 180 top
C302  100nF  [C-0805"]  114.5,39.5 180 top
C303  100nF  [C-0805"]  184,60 180 top
C304  100nF  [C-0805"]  130,38 0 top
C305  100nF  [C-0805"]  56,153 270 top
C401  100nF  [C-0805"]  55,222 0 top
C402  1nF  [C-0805"]  57,198 270 top
C403  1nF  [C-0805"]  57,202 90 top
C404  100nF  [C-0805"]  77,221.5 0 top
C405  100nF  [C-0805"]  63,204 180 top
C406  NB  [C-0805"]  63,219 90 top
C407  NB  [C-0805"]  45,220 90 top
C408  NB  [C-0805"]  74,203 90 top
C409  NB  [C-0805"]  83,216 90 top
C410  NB  [C-0805"]  72,214 270 top
C411  NB  [C-0805"]  80,201 180 bottom
C501  100nF  [C-0805"]  15,75 180 top
C502  100nF  [C-0805"]  15,108 180 top
C503  68p  [C-0805"]  22,76 90 top
C504  68p  [C-0805"]  20,80 270 top
C505  68p  [C-0805"]  7,77 90 top
C506  68p  [C-0805"]  7,81 270 top
C507  68p  [C-0805"]  7,109 90 top
C508  68p  [C-0805"]  7,113 270 top
C509  NB  [C-0805"]  27,126 90 top
C510  100nF  [C-0805"]  51,81 180 top
C511  NB  [C-0805"]  28,82 90 top
C512  NB  [C-0805"]  38,82 90 top
C513  NB  [C-0805"]  28,86 270 top
C514  NB  [C-0805"]  38,86 270 top
C515  NB  [C-0805"]  28,98 90 top
C516  NB  [C-0805"]  38,98 90 top
C517  100nF  [C-0805"]  33,76 180 top
C518  100nF  [C-0805"]  33,84 180 top
C519  100nF  [C-0805"]  33,92 180 top
C520  NB  [C-0805"]  44,86 180 top
C601  100nF  [C-0805"]  224,115 0 top
C602  100nF  [C-0805"]  224,82 0 top
C603  68p  [C-0805"]  218,114 270 top
C604  68p  [C-0805"]  216,110 90 top
C605  68p  [C-0805"]  232,113 270 top
C606  68p  [C-0805"]  232,109 90 top
C607  68p  [C-0805"]  232,81 270 top
C608  68p  [C-0805"]  232,77 90 top
C609  NB  [C-0805"]  227,45 0 top
C610  100nF  [C-0805"]  206,62 90 top
C611  NB  [C-0805"]  210,114 90 top
C612  NB  [C-0805"]  199,113 180 top
C613  NB  [C-0805"]  206,102 270 top
C614  NB  [C-0805"]  216,106 90 top
C615  NB  [C-0805"]  206,98 90 top
C616  NB  [C-0805"]  216,94 270 top
C617  100nF  [C-0805"]  205,116 0 top
C618  100nF  [C-0805"]  211,100 180 top
C619  100nF  [C-0805"]  211,92 180 top
C620  NB  [C-0805"]  215,68 0 top
C701  NB  [C-0805"]  187,94 0 top
C702  NB  [C-0805"]  176,109 0 top
C703  100nF  [C-0805"]  160,97 180 top
C704  10nF  [C-0805"]  175,98 270 top
C705  10nF  [C-0805"]  189,105 90 top
C706  100nF  [C-0805"]  180,84 180 top
C707  100nF  [C-0805"]  182,95 0 top
C708  1µF  [C-0805"]  173,98 90 top
C709  1µF  [C-0805"]  186,89 270 top
C710  NB  [C-0805"]  186,85 90 top
C711  NB  [C-0805"]  169,88 0 top
C712  NB  [C-0805"]  169,86 0 top
C801  NB  [C-0805"]  40,128 180 top
C802  NB  [C-0805"]  73,116 0 bottom
C803  NB  [C-0805"]  40,124 180 top
C804  NB  [C-0805"]  73,118 0 bottom
C805  NB  [C-0805"]  40,120 180 top
C806  NB  [C-0805"]  73,120 0 bottom
C807  NB  [C-0805"]  40,116 180 top
C808  NB  [C-0805"]  73,122 0 bottom
C809  NB  [C-0805"]  65,118 90 bottom
C810  100nF  [C-0805"]  54,114.5 180 top
C811  100nF  [C-0805"]  68.5,114.5 0 top
C812  100nF  [C-0805"]  75,129 270 top
C901  NB  [C-0805"]  165,79 180 top
C902  NB  [C-0805"]  197,66 0 bottom
C903  NB  [C-0805"]  165,75 180 top
C904  NB  [C-0805"]  197,68 0 bottom
C905  NB  [C-0805"]  165,71 180 top
C906  NB  [C-0805"]  197,70 0 bottom
C907  NB  [C-0805"]  165,67 180 top
C908  NB  [C-0805"]  197,72 0 bottom
C909  100nF  [C-0805"]  183,75.5 180 top
C910  100nF  [C-0805"]  194,75.5 0 top
C911  100nF  [C-0805"]  194,55 90 bottom
C1001  100nF  [C-0805"]  36,24 180 top
C1002  100nF  [C-0805"]  45,32 180 bottom
C1003  100nF  [C-0805"]  49,18 180 top
C1004  10u  [CP-1210"]  50,15.5 0 top
C1005  100nF  [C-0805"]  45,30 180 bottom
C1006  100nF  [C-0805"]  43,24 0 bottom
C1007  4µ7  [CP-1206"]  45.5,35 0 bottom
C1008  4µ7  [CP-1206"]  43.5,22 180 bottom
C1009  2µ2  [C-0805"]  8,26 180 top
C1010  2µ2  [C-0805"]  8,28 180 top
C1011  22pF  [C-0805"]  46.5,35.5 90 top
C1012  22pF  [C-0805"]  37.5,35.5 270 top
C1013  100nF  [C-0805"]  19,27 270 top
C1014  2µ2  [C-0805"]  21,27 270 top
C1015  100pF  [C-0805"]  31,15 90 top
C1016  100pF  [C-0805"]  30,10 270 top
C1017  100nF  [C-0805"]  22,13 180 bottom
C1018  2µ2  [C-0805"]  15,23 90 top
C1019  100nF  [C-0805"]  17,23 90 top
C1020  100nF  [C-0805"]  26,26 0 top
C1021  2µ2  [C-0805"]  26,24 0 top
C1022  100nF  [C-0805"]  26,22 0 top
C1023  NB  [C-0805"]  34,14 0 bottom
C1101  NB  [C-0805"]  53,13 180 top
C1102  NB  [C-0805"]  49,9 0 bottom
C1103  NB  [C-0805"]  45,9 180 bottom
C1104  10nF  [C-0805"]  63,20 0 top
C1105  10nF  [C-0805"]  81,6 180 top
C1106  10nF  [C-0805"]  61,12 0 top
C1107  NB  [C-0805"]  68,5 270 top
C1108  100nF  [C-0805"]  66,3 270 top
C1109  NB  [C-0805"]  68,15 270 top
C1110  100nF  [C-0805"]  66,13 270 top
C1111  NB  [C-0805"]  78,13 90 top
C1112  100nF  [C-0805"]  80,15 90 top
C1113  100nF  [C-0805"]  73,19 180 top
C1114  100nF  [C-0805"]  73,9 180 top
C1115  100nF  [C-0805"]  64,17 90 top
C1116  100nF  [C-0805"]  82,11 270 top
C1117  100nF  [C-0805"]  64,7 90 top
C1118  NB  [C-0805"]  93,18 90 top
C1119  NB  [C-0805"]  109,17 90 top
C1120  NB  [C-0805"]  93,10 90 top
C1121  100nF  [C-0805"]  100,20 180 top
C1122  100nF  [C-0805"]  100,12 180 top
C1123  NB  [C-0805"]  95,14 270 top
C1124  NB  [C-0805"]  107,13 270 top
C1125  NB  [C-0805"]  95,6 270 top
C1126  NB  [C-0805"]  58,84 0 top
C1201  100nF  [C-0805"]  163,23 180 top
C1202  100nF  [C-0805"]  172,32 180 bottom
C1203  100nF  [C-0805"]  177,18 180 top
C1204  10µ  [CP-1210"]  178,15.5 0 top
C1205  100nF  [C-0805"]  172,34 180 bottom
C1206  100nF  [C-0805"]  172.5,23.5 180 bottom
C1207  4µ7  [CP-1206"]  172.5,36 0 bottom
C1208  4µ7  [CP-1206"]  173,21.5 0 bottom
C1209  2µ2  [C-0805"]  150,6 270 top
C1210  2µ2  [C-0805"]  152,6 270 top
C1211  22pF  [C-0805"]  176,36 90 top
C1212  22pF  [C-0805"]  170,40 0 top
C1213  100nF  [C-0805"]  144,28 270 top
C1214  2µ2  [C-0805"]  146,28 270 top
C1215  100pF  [C-0805"]  157,15 90 top
C1216  100pF  [C-0805"]  156,10 270 top
C1217  100nF  [C-0805"]  148,13 180 bottom
C1218  2µ2  [C-0805"]  140,24 90 top
C1219  100nF  [C-0805"]  142,24 90 top
C1220  100nF  [C-0805"]  151,27 0 top
C1221  2µ2  [C-0805"]  151,25 0 top
C1222  100nF  [C-0805"]  151,23 0 top
C1223  NB  [C-0805"]  160,13 0 bottom
C1301  NB  [C-0805"]  179,13 180 top
C1302  NB  [C-0805"]  176,9 0 bottom
C1303  NB  [C-0805"]  172,9 180 bottom
C1304  10nF  [C-0805"]  189,20 0 top
C1305  10nF  [C-0805"]  207,6 180 top
C1306  10nF  [C-0805"]  187,12 0 top
C1307  10nF  [C-0805"]  194,15 270 top
C1308  100nF  [C-0805"]  192,13 270 top
C1309  10nF  [C-0805"]  204,13 270 top
C1310  100nF  [C-0805"]  206,15 90 top
C1311  10nF  [C-0805"]  194,5 90 top
C1312  100nF  [C-0805"]  192,3 270 top
C1313  100nF  [C-0805"]  199,19 180 top
C1314  100nF  [C-0805"]  199,9 180 top
C1315  100nF  [C-0805"]  190,17 90 top
C1316  100nF  [C-0805"]  208,11 270 top
C1317  100nF  [C-0805"]  190,7 90 top
C1318  NB  [C-0805"]  218,18 90 top
C1319  NB  [C-0805"]  234,17 90 top
C1320  NB  [C-0805"]  218,10 90 top
C1321  100nF  [C-0805"]  225,20 180 top
C1322  100nF  [C-0805"]  225,12 180 top
C1323  NB  [C-0805"]  220,14 270 top
C1324  NB  [C-0805"]  232,13 270 top
C1325  NB  [C-0805"]  220,6 270 top
C1326  NB  [C-0805"]  209,56 270 top
C1401  [C-0805"]  40,73 270 bottom
C1402  [C-0805"]  71,73 270 bottom
C1403  [C-0805"]  171,121 90 bottom
C1404  [C-0805"]  202,121 90 bottom
D101  MBR2H200SFT1G  [D-0805"]  138,117 180 top
D102  MBR2H200SFT1G  [D-0805"]  138,78 180 top
D201  MBR2H200SFT1G  [D-0805"]  128,66 0 bottom
D1001  TS41480805  [D-0805"]  16,7 0 top
D1002  TS41480805  [D-0805"]  16,9 180 top
D1003  TS41480805  [D-0805"]  16,15 0 top
D1004  TS41480805  [D-0805"]  16,17 180 top
D1201  TS41480805  [D-0805"]  142,7 0 top
D1202  TS41480805  [D-0805"]  142,9 180 top
D1203  TS41480805  [D-0805"]  142,15 0 top
D1204  TS41480805  [D-0805"]  142,17 180 top
DCDC201  TSR 1-2450  [TSR-1]  61,183 180 top
DCDC202  TSR 1-2433  [TSR-1]  77,183 0 top
H201  MOUNT-HOLE5.5  [5,5]  29.8,37 0 top
H202  MOUNT-HOLE5.5  [5,5]  79.8,37 0 top
H203  MOUNT-HOLE5.5  [5,5]  79.8,153 0 top
H204  MOUNT-HOLE5.5  [5,5]  29.8,153 0 top
H205  MOUNT-HOLE5.5  [5,5]  160.2,37 0 top
H206  MOUNT-HOLE5.5  [5,5]  210.2,37 0 top
H207  MOUNT-HOLE5.5  [5,5]  210.2,153 0 top
H208  MOUNT-HOLE5.5  [5,5]  160.2,153 0 top
I501  HC2F  [HC2F]  12.1,61.9 90 top
I502  HC2F  [HC2F]  12.1,95 90 top
I503  HC2F  [HC2F]  12.1,128.1 90 top
I601  HC2F  [HC2F]  227.9,128.1 270 top
I602  HC2F  [HC2F]  227.9,95 270 top
I603  HC2F  [HC2F]  227.9,61.9 270 top
IC201  LT1461  [SO8]  30,112 90 top
IC202  LT1461  [SO8]  231,37 0 top
IC203  LT1461  [SO8]  28,54 0 top
IC301  74HCT367M  [SOIC16]  56,137 270 top
IC302  74HCT367M  [SOIC16]  115,33 270 top
IC303  74LVC32AD  [SOIC14]  129.5,32.5 90 top
IC304  74HCT367M  [SOIC16]  184,53 270 top
IC305  74LVC32AD  [SOIC14]  50.5,152 0 top
IC401  OPA2350EA  [SOIC8]  64,200 270 top
IC402  LMC6772AIM  [SOIC8]  55,218 90 top
IC403  74HC74D  [SOIC14]  78,216 270 top
IC501  OPA2350EA  [SOIC8]  15,79 270 top
IC502  OPA2350EA  [SOIC8]  15,112 270 top
IC503  LMC6772AIM  [SOIC8]  33,80 270 top
IC504  LMC6772AIM  [SOIC8]  33,88 270 top
IC505  LMC6772AIM  [SOIC8]  33,96 270 top
IC506  74HC74D  [SOIC14]  51,87 270 top
IC601  OPA2350EA  [SOIC8]  224,111 90 top
IC602  OPA2350EA  [SOIC8]  224,78 90 top
IC603  LMC6772AIM  [SOIC8]  205,112 90 top
IC604  LMC6772AIM  [SOIC8]  211,104 270 top
IC605  LMC6772AIM  [SOIC8]  211,96 270 top
IC606  74HC74D  [SOIC14]  212,62 180 top
IC701  74HC123M  [SO16]  181,102 90 top
IC702  LMC6772AIM  [SOIC8]  180,88 270 top
IC703  74HC74D  [SOIC14]  160,91.5 270 top
IC801  74HC21D  [SOIC14]  54,120 270 top
IC802  74HC21D  [SOIC14]  69,120 90 top
IC803  74LVC02D  [SOIC14]  69,129 0 top
IC901  74HC21D  [SOIC14]  183,70 270 top
IC902  74HC21D  [SOIC14]  194,70 90 top
IC903  74LVC02D  [SOIC14]  194,57.5 90 top
IC1001  AD2S1205  [TQFP44]  44.91,26.83 180 top
IC1002  TL084D  [SO14]  23,13 90 top
IC1003  REF3330  [SOT23]  16,27 180 top
IC1004  LMH6645MF  [SOT23-5]  20,23 270 top
IC1101  OPA2350EA  [SOIC8]  73,15 270 top
IC1102  OPA2350EA  [SOIC8]  73,5 270 top
IC1103  LMC6772AIM  [SOIC8]  101,16 270 top
IC1104  LMC6772AIM  [SOIC8]  101,8 270 top
IC1201  AD2S1205  [TQFP44]  172,27 180 top
IC1202  TL084D  [SO14]  149,13 90 top
IC1203  REF3330  [SOT23]  141,28 180 top
IC1204  LMH6645MF  [SOT23-5]  145,24 270 top
IC1301  OPA2350EA  [SOIC8]  199,15 270 top
IC1302  OPA2350EA  [SOIC8]  199,5 270 top
IC1303  LMC6772AIM  [SOIC8]  226,16 270 top
IC1304  LMC6772AIM  [SOIC8]  226,8 270 top
J101  Female  [SMA_KLEIN]  22,178 0 top
J102  Female  [SMA_KLEIN]  22,166 0 top
J301  79109-22  [79109-22]  54.79,147.27 0 bottom
J302  79109-22  [79109-22]  185.2,42.7 180 bottom
J401  Female  [SMA_KLEIN]  22,220 0 top
J501  Female  [SMA_KLEIN]  10,39 0 top
J601  Female  [SMA_KLEIN]  221,163 270 top
L501  10µH  [L3230M]  29,123 180 top
L601  10µH  [L3230M]  223,44 90 top
L1001  10µH  [L-1206]  58,34 180 top
L1002  10µH  [L-1206]  30,23 270 top
L1003  10µH  [L-1206]  12,30 270 top
L1201  10µH  [L-1206]  155,30 0 top
L1202  10µH  [L-1206]  147,33 270 top
L1203  10µH  [L-1206]  128,12 180 bottom
LED401  [LED-0805"]  86,205 180 top
LP101  LAUNCHPAD-CANM  [LAUNCHPAD_M]  148,185 90 top
Q1001  QUARZ10MHZ  [CRYSTAL3.2X5]  42,36 0 top
Q1201  QUARZ10MHZ  [CRYSTAL3.2X5]  171.5,36.5 0 top
R101  0  [R-0805"]  138,130 180 top
R102  0  [R-0805"]  138,136 180 top
R103  0  [R-0805"]  138,140 180 top
R104  0  [R-0805"]  138,145 180 top
R105  0  [R-0805"]  138,67 180 top
R106  0  [R-0805"]  138,72 180 top
R107  0  [R-0805"]  138,125 180 top
R108  10k  [R-0805"]  138,119 180 top
R109  0  [R-0805"]  138,138 180 top
R110  0  [R-0805"]  138,143 180 top
R111  0  [R-0805"]  138,74 180 top
R112  10k  [R-0805"]  138,80 180 top
R113  0  [R-0805"]  138,85 180 top
R114  0  [R-0805"]  138,127 180 top
R115  0  [R-0805"]  138,122 180 top
R116  50  [R-0805"]  33,178 0 top
R117  50  [R-0805"]  33,166 0 top
R201  0  [R-0805"]  128,68 0 bottom
R202  0  [R-0805"]  132,66 0 bottom
R203  0  [R-0805"]  137,148 270 top
R301  10k  [R-0805"]  49,140 90 bottom
R302  10k  [R-0805"]  63,140 90 bottom
R303  10k  [R-0805"]  47,140 90 bottom
R304  10k  [R-0805"]  65,140 90 bottom
R305  10k  [R-0805"]  45,140 90 bottom
R306  10k  [R-0805"]  65,153 270 bottom
R307  0  [R-0805"]  63,153 90 bottom
R308  10k  [R-0805"]  191,49 270 bottom
R309  10k  [R-0805"]  177,49 270 bottom
R310  10k  [R-0805"]  193,49 270 bottom
R311  10k  [R-0805"]  175,49 270 bottom
R312  10k  [R-0805"]  195,49 270 bottom
R313  10k  [R-0805"]  170,41 180 bottom
R314  0  [R-0805"]  177,37 270 bottom
R401  10k  [R-0805"]  51,198 90 top
R402  22k  [R-0805"]  53,202 90 top
R403  22k  [R-0805"]  53,198 90 top
R404  33k  [R-0805"]  55,198 90 top
R405  33k  [R-0805"]  55,202 270 top
R406  47  [R-0805"]  30,220 0 top
R407  [R-0805"]  61,219 90 top
R408  [R-0805"]  65,219 270 top
R409  [R-0805"]  49,220 270 top
R410  [R-0805"]  47,220 90 top
R411  [R-0805"]  70,203 270 top
R412  [R-0805"]  72,203 90 top
R413  10k  [R-0805"]  61,215 270 top
R414  10k  [R-0805"]  49,216 270 top
R415  0  [R-0805"]  76,201 180 bottom
R416  0  [R-0805"]  63,215 270 top
R417  0  [R-0805"]  47,216 270 top
R418  10k  [R-0805"]  90,205 0 top
R419  10k  [R-0805"]  86,209 180 bottom
R501  22k  [R-0805"]  5,77 90 top
R502  150k  [R-0805"]  5,81 90 top
R503  22k  [R-0805"]  3,81 270 top
R504  22k  [R-0805"]  24,76 90 top
R505  150k  [R-0805"]  24,80 90 top
R506  22k  [R-0805"]  26,80 270 top
R507  22k  [R-0805"]  5,109 90 top
R508  150k  [R-0805"]  3,113 90 top
R509  22k  [R-0805"]  5,113 270 top
R510  15k  [R-0805"]  20,76 90 top
R511  15k  [R-0805"]  22,80 90 top
R512  15k  [R-0805"]  9,77 90 top
R513  15k  [R-0805"]  9,81 90 top
R514  15k  [R-0805"]  9,109 90 top
R515  15k  [R-0805"]  9,113 90 top
R516  47  [R-0805"]  18,39 0 top
R517  0  [R-0805"]  24,84 270 bottom
R518  0  [R-0805"]  26,84 90 bottom
R519  0  [R-0805"]  24,80 90 bottom
R520  0  [R-0805"]  26,80 270 bottom
R521  0  [R-0805"]  28,78 90 top
R522  0  [R-0805"]  39,79 180 top
R523  0  [R-0805"]  28,90 270 top
R524  0  [R-0805"]  38,90 270 top
R525  0  [R-0805"]  28,94 90 top
R526  0  [R-0805"]  38,94 90 top
R527  10k  [R-0805"]  44,90 0 top
R528  0  [R-0805"]  44,88 0 top
R601  22k  [R-0805"]  234,113 270 top
R602  150k  [R-0805"]  236,109 270 top
R603  22k  [R-0805"]  234,109 90 top
R604  22k  [R-0805"]  214,114 270 top
R605  150k  [R-0805"]  212,110 270 top
R606  22k  [R-0805"]  214,110 90 top
R607  22k  [R-0805"]  234,81 270 top
R608  150k  [R-0805"]  236,77 270 top
R609  22k  [R-0805"]  234,77 90 top
R610  15k  [R-0805"]  216,114 270 top
R611  15k  [R-0805"]  218,110 270 top
R612  15k  [R-0805"]  230,113 270 top
R613  15k  [R-0805"]  230,109 270 top
R614  15k  [R-0805"]  230,81 270 top
R615  15k  [R-0805"]  230,77 270 top
R616  47  [R-0805"]  221,153 270 top
R617  0  [R-0805"]  212,110 270 bottom
R618  0  [R-0805"]  210,110 90 bottom
R619  0  [R-0805"]  212,106 90 bottom
R620  0  [R-0805"]  210,106 270 bottom
R621  0  [R-0805"]  210,110 90 top
R622  0  [R-0805"]  200,110 90 top
R623  0  [R-0805"]  206,106 270 top
R624  0  [R-0805"]  216,102 90 top
R625  0  [R-0805"]  206,94 90 top
R626  0  [R-0805"]  216,98 270 top
R627  10k  [R-0805"]  210,69 270 top
R628  0  [R-0805"]  212,69 270 top
R701  0  [R-0805"]  187,96 180 top
R702  0  [R-0805"]  180,109 180 top
R703  12k  [R-0805"]  176,95 180 top
R704  12k  [R-0805"]  191,105 90 top
R705  33k  [R-0805"]  174,101 0 top
R706  NB  [R-0805"]  174,103 0 top
R707  33k  [R-0805"]  190,102 180 top
R708  NB  [R-0805"]  190,100 180 top
R709  [R-0805"]  190,85 90 top
R710  [R-0805"]  188,85 270 top
R711  0  [R-0805"]  173,92 0 top
R712  0  [R-0805"]  174,88 90 top
R713  10k  [R-0805"]  169,92 180 top
R714  10k  [R-0805"]  174,84 270 top
R715  0  [R-0805"]  169,90 180 top
R716  0  [R-0805"]  169,84 180 top
R801  10k  [R-0805"]  46,126 0 bottom
R802  10k  [R-0805"]  46,120 0 bottom
R803  0  [R-0805"]  61,118 90 bottom
R804  10k  [R-0805"]  46,122 0 bottom
R805  10k  [R-0805"]  46,116 0 bottom
R806  0  [R-0805"]  77,116 180 top
R807  0  [R-0805"]  77,120 180 top
R808  0  [R-0805"]  77,118 180 top
R809  0  [R-0805"]  77,122 180 top
R810  NB  [R-0805"]  40,126 0 bottom
R811  22k  [R-0805"]  40,126 0 top
R812  NB  [R-0805"]  40,122 0 bottom
R813  22k  [R-0805"]  40,122 0 top
R814  NB  [R-0805"]  40,120 0 bottom
R815  22k  [R-0805"]  40,118 0 top
R816  NB  [R-0805"]  40,116 0 bottom
R817  22k  [R-0805"]  40,114 0 top
R818  NB  [R-0805"]  77,116 180 bottom
R819  NB  [R-0805"]  77,118 180 bottom
R820  NB  [R-0805"]  77,120 180 bottom
R821  NB  [R-0805"]  77,122 180 bottom
R822  10k  [R-0805"]  63,118 270 bottom
R901  10k  [R-0805"]  173,75 0 bottom
R902  10k  [R-0805"]  173,71 0 bottom
R903  0  [R-0805"]  195,64 180 top
R904  10k  [R-0805"]  173,73 0 bottom
R905  10k  [R-0805"]  173,69 0 bottom
R906  0  [R-0805"]  202,66 180 top
R907  0  [R-0805"]  202,70 180 top
R908  0  [R-0805"]  202,68 180 top
R909  0  [R-0805"]  202,72 180 top
R910  NB  [R-0805"]  165,77 0 bottom
R911  22k  [R-0805"]  165,77 0 top
R912  NB  [R-0805"]  165,73 0 bottom
R913  22k  [R-0805"]  165,73 0 top
R914  NB  [R-0805"]  165,69 0 bottom
R915  22k  [R-0805"]  165,69 0 top
R916  NB  [R-0805"]  165,65 0 bottom
R917  22k  [R-0805"]  165,65 0 top
R918  NB  [R-0805"]  202,66 180 bottom
R919  NB  [R-0805"]  202,68 180 bottom
R920  NB  [R-0805"]  202,70 180 bottom
R921  NB  [R-0805"]  202,72 180 bottom
R1001  0  [R-0805"]  36,26 0 top
R1002  10k  [R-0805"]  53,28 270 top
R1003  10k  [R-0805"]  47,27 180 bottom
R1004  0  [R-0805"]  33,23 270 top
R1005  10k  [R-0805"]  44,15 180 top
R1006  10k  [R-0805"]  40,15 180 top
R1007  10k  [R-0805"]  32,10 90 top
R1008  10k  [R-0805"]  33,15 270 top
R1009  18k  [R-0805"]  29,15 90 top
R1010  18k  [R-0805"]  28,10 270 top
R1011  3R3  [R-0805"]  12,7 180 top
R1012  3R3  [R-0805"]  12,11 0 top
R1013  3R3  [R-0805"]  12,15 180 top
R1014  3R3  [R-0805"]  12,19 0 top
R1015  3k  [R-0805"]  23,22 90 top
R1016  12k  [R-0805"]  20,20 0 top
R1017  2k2  [R-0805"]  12,5 180 top
R1018  2k2  [R-0805"]  12,9 0 top
R1019  2k2  [R-0805"]  12,13 180 top
R1020  2k2  [R-0805"]  12,17 0 top
R1021  4R7  [R-0805"]  4,7 0 top
R1022  4R7  [R-0805"]  4,9 180 top
R1023  4R7  [R-0805"]  4,15 0 top
R1024  4R7  [R-0805"]  4,17 180 top
R1025  NB  [R-0805"]  34,12 180 bottom
R1101  0  [R-0805"]  53,11 180 top
R1102  0  [R-0805"]  49,7 0 bottom
R1103  0  [R-0805"]  45,7 180 bottom
R1104  10k  [R-0805"]  59,16 180 top
R1105  10k  [R-0805"]  86,11 270 top
R1106  10k  [R-0805"]  60,7 90 top
R1107  10k  [R-0805"]  59,18 180 top
R1108  1k  [R-0805"]  59,20 0 top
R1109  10k  [R-0805"]  85,8 0 top
R1110  1k  [R-0805"]  81,8 0 top
R1111  10k  [R-0805"]  65,10 0 top
R1112  1k  [R-0805"]  61,10 0 top
R1113  22k  [R-0805"]  62,17 90 top
R1114  22k  [R-0805"]  61,14 0 top
R1115  22k  [R-0805"]  84,11 270 top
R1116  22k  [R-0805"]  85,14 180 top
R1117  22k  [R-0805"]  62,7 90 top
R1118  22k  [R-0805"]  61,4 0 top
R1119  22k  [R-0805"]  64,13 90 top
R1120  22k  [R-0805"]  82,15 270 top
R1121  22k  [R-0805"]  64,3 90 top
R1122  22k  [R-0805"]  66,17 270 top
R1123  22k  [R-0805"]  80,11 90 top
R1124  22k  [R-0805"]  66,7 270 top
R1125  0  [R-0805"]  91,18 270 top
R1126  0  [R-0805"]  111,17 270 top
R1127  0  [R-0805"]  91,10 270 top
R1128  0  [R-0805"]  88,4 180 top
R1129  NB  [R-0805"]  95,18 270 top
R1130  NB  [R-0805"]  107,17 270 top
R1131  NB  [R-0805"]  95,10 270 top
R1132  0  [R-0805"]  88,6 0 top
R1133  0  [R-0805"]  93,14 270 top
R1134  0  [R-0805"]  109,13 270 top
R1135  0  [R-0805"]  93,6 270 top
R1136  0  [R-0805"]  99,22 180 bottom
R1137  0  [R-0805"]  103,22 0 bottom
R1138  0  [R-0805"]  101,11 90 bottom
R1139  10k  [R-0805"]  58,88 180 top
R1140  0  [R-0805"]  58,86 180 top
R1201  0  [R-0805"]  163,25 0 top
R1202  10k  [R-0805"]  181,25 180 top
R1203  10k  [R-0805"]  181,27 180 top
R1204  0  [R-0805"]  159,22 270 top
R1205  10k  [R-0805"]  170,14 180 top
R1206  10k  [R-0805"]  166,14 180 top
R1207  10k  [R-0805"]  158,10 90 top
R1208  10k  [R-0805"]  159,15 270 top
R1209  18k  [R-0805"]  155,15 90 top
R1210  18k  [R-0805"]  154,10 270 top
R1211  3R3  [R-0805"]  138,7 180 top
R1212  3R3  [R-0805"]  138,11 0 top
R1213  3R3  [R-0805"]  138,15 180 top
R1214  3R3  [R-0805"]  138,19 0 top
R1215  3k  [R-0805"]  148,23 90 top
R1216  12k  [R-0805"]  145,21 0 top
R1217  2k2  [R-0805"]  138,5 180 top
R1218  2k2  [R-0805"]  138,9 0 top
R1219  2k2  [R-0805"]  138,13 180 top
R1220  2k2  [R-0805"]  138,17 0 top
R1221  4R7  [R-0805"]  130,7 0 top
R1222  4R7  [R-0805"]  130,9 180 top
R1223  4R7  [R-0805"]  130,15 0 top
R1224  4R7  [R-0805"]  130,17 180 top
R1225  NB  [R-0805"]  160,11 180 bottom
R1301  0  [R-0805"]  179,11 180 top
R1302  0  [R-0805"]  176,7 0 bottom
R1303  0  [R-0805"]  172,7 0 bottom
R1304  10k  [R-0805"]  185,16 180 top
R1305  10k  [R-0805"]  212,11 270 top
R1306  10k  [R-0805"]  186,7 90 top
R1307  10k  [R-0805"]  185,18 180 top
R1308  1k  [R-0805"]  185,20 0 top
R1309  10k  [R-0805"]  211,8 0 top
R1310  1k  [R-0805"]  207,8 0 top
R1311  10k  [R-0805"]  191,10 0 top
R1312  1k  [R-0805"]  187,10 0 top
R1313  22k  [R-0805"]  188,17 90 top
R1314  22k  [R-0805"]  187,14 0 top
R1315  22k  [R-0805"]  210,11 270 top
R1316  22k  [R-0805"]  211,14 180 top
R1317  22k  [R-0805"]  188,7 90 top
R1318  22k  [R-0805"]  187,4 0 top
R1319  22k  [R-0805"]  190,13 90 top
R1320  22k  [R-0805"]  208,15 270 top
R1321  22k  [R-0805"]  190,3 90 top
R1322  22k  [R-0805"]  192,17 270 top
R1323  22k  [R-0805"]  206,11 90 top
R1324  22k  [R-0805"]  192,7 270 top
R1325  0  [R-0805"]  216,18 270 top
R1326  0  [R-0805"]  236,17 270 top
R1327  0  [R-0805"]  216,10 270 top
R1328  [R-0805"]  219,2 180 bottom
R1329  NB  [R-0805"]  220,18 270 top
R1330  NB  [R-0805"]  232,17 270 top
R1331  NB  [R-0805"]  220,10 270 top
R1332  [R-0805"]  215,2 180 bottom
R1333  0  [R-0805"]  218,14 270 top
R1334  0  [R-0805"]  234,13 270 top
R1335  0  [R-0805"]  218,6 270 top
R1336  0  [R-0805"]  223,23 180 bottom
R1337  0  [R-0805"]  227,23 0 bottom
R1338  0  [R-0805"]  225,15 90 bottom
R1339  10k  [R-0805"]  214,55 0 top
R1340  0  [R-0805"]  211,56 90 top
T401  ZXMN3F30FHTA  [SOT23]  80,204 0 bottom
T402  ZXMN3F30FHTA  [SOT23]  80,209 0 bottom
T1001  BC846  [SOT23]  8,6 180 top
T1002  BC856  [SOT23-BEC]  8,10 180 top
T1003  BC846  [SOT23]  8,14 180 top
T1004  BC856  [SOT23-BEC]  8,18 180 top
T1201  BC846  [SOT23]  134,6 180 top
T1202  BC856  [SOT23-BEC]  134,10 180 top
T1203  BC846  [SOT23]  134,14 180 top
T1204  BC856  [SOT23-BEC]  134,18 180 top
TP1  TP-TH-08  [TP-08]  133,196 0 top
TP2  TP-TH-12  [TP-12]  30,178 0 top
TP3  TP-TH-12  [TP-12]  30,166 0 top
TP4  TP-TH-12  [TP-12]  67,190 0 top
TP5  TP-TH-12  [TP-12]  24,110 0 top
TP6  TP-TH-12  [TP-12]  57,190 0 top
TP7  TP-TH-12  [TP-12]  81,192 0 top
TP8  TP-TH-12  [TP-12]  232,45 180 top
TP9  TP-TH-12  [TP-12]  28,62 180 top
TP10  TP-TH-08  [TP-08]  70,148 0 top
TP11  TP-TH-08  [TP-08]  60,131 0 top
TP12  TP-TH-08  [TP-08]  49,142.5 0 top
TP13  TP-TH-08  [TP-08]  160,59 0 top
TP14  TP-TH-08  [TP-08]  191,43 0 top
TP15  TP-TH-08  [TP-08]  38,195 0 top
TP16  TP-TH-08  [TP-08]  38,197 180 top
TP17  TP-TH-08  [TP-08]  65,215 0 top
TP18  TP-TH-12  [TP-12]  47,224 180 top
TP19  TP-TH-08  [TP-08]  45,216 0 top
TP20  TP-TH-08  [TP-08]  70,200 0 top
TP21  TP-TH-08  [TP-08]  198,88 0 top
TP22  TP-TH-08  [TP-08]  28,71 0 top
TP23  TP-TH-12  [TP-12]  19,44 0 top
TP24  TP-TH-08  [TP-08]  26,88 270 top
TP25  TP-TH-08  [TP-08]  214,122 0 top
TP26  TP-TH-12  [TP-12]  215,140 0 top
TP27  TP-TH-08  [TP-08]  199,115 0 top
TP28  TP-TH-08  [TP-08]  171,99 0 top
TP29  TP-TH-08  [TP-08]  193,102 0 top
TP30  TP-TH-08  [TP-08]  9,23 0 top
TP31  TP-TH-08  [TP-08]  58,14 0 top
TP32  TP-TH-08  [TP-08]  88,10 0 top
TP33  TP-TH-08  [TP-08]  57,3 0 top
TP34  TP-TH-08  [TP-08]  91,14 0 top
TP35  TP-TH-08  [TP-08]  114,14 0 top
TP36  TP-TH-08  [TP-08]  90.75,6.75 0 top
TP37  TP-TH-08  [TP-08]  98,3 0 top
TP38  TP-TH-08  [TP-08]  151,20 0 top
TP39  TP-TH-08  [TP-08]  184,14 0 top
TP40  TP-TH-08  [TP-08]  214,10 0 top
TP41  TP-TH-08  [TP-08]  184,3 0 top
TP42  TP-TH-08  [TP-08]  216,14 0 top
TP43  TP-TH-08  [TP-08]  236,13 0 top
TP44  TP-TH-08  [TP-08]  216,6 0 top
TP45  TP-TH-08  [TP-08]  223,3 0 top
TP46  TP-TH-12  [TP-12]  156,6 0 top
U1401  TMV2  [TMV2]  42,74 270 top
U1402  TMV2  [TMV2]  51,74 270 top
U1403  TMV2  [TMV2]  60,74 270 top
U1404  TMV2  [TMV2]  69,74 270 top
U1405  TMV2  [TMV2]  200,120 90 top
U1406  TMV2  [TMV2]  191,120 90 top
U1407  TMV2  [TMV2]  182,120 90 top
U1408  TMV2  [TMV2]  173,120 90 top
X101  Softauge  [ML-2~10]  127,196 90 top
X201  MINIBRIDGE12-GERADE  [MINIBRIDGE12-GERADE]  110,210 90 top
X401  UDC_Messung  [MINIBRIDGE6-ABGEWINKELT]  30,197 270 top
X1101  MINIBRIDGE12-GERADE  [MINIBRIDGE12-GERADE]  44,5 0 top
X1301  MINIBRIDGE12-GERADE  [MINIBRIDGE12-GERADE]  170,5 0 top
X1401  M1  [44769-2201_EUGEN]  54.8,48.15 180 bottom
X1402  M2  [44769-2201_EUGEN]  185.2,141.85 0 bottom
Z1401  20V  [D-SOD123W]  42,54 90 top
Z1402  12V  [D-SOD123W]  40,54 270 top
Z1403  20V  [D-SOD123W]  51,54 90 top
Z1404  12V  [D-SOD123W]  49,54 270 top
Z1405  20V  [D-SOD123W]  60,54 90 top
Z1406  12V  [D-SOD123W]  58,54 270 top
Z1407  20V  [D-SOD123W]  69,54 90 top
Z1408  12V  [D-SOD123W]  67,54 270 top
Z1409  20V  [D-SOD123W]  197,147 270 top
Z1410  12V  [D-SOD123W]  199,147 90 top
Z1411  20V  [D-SOD123W]  191,147 270 top
Z1412  12V  [D-SOD123W]  189,147 90 top
Z1413  20V  [D-SOD123W]  182,147 270 top
Z1414  12V  [D-SOD123W]  180,147 90 top
Z1415  20V  [D-SOD123W]  171,147 270 top
Z1416  12V  [D-SOD123W]  173,147 90 top

## Tracks (layer width: path | path; a pad name or v marks a point on that pad's centre or on a via)
!FLT_B1  (via drill 0.3)
  Route3 0.406: v61,143 60,143 58,141 58,134 55,131 55,129 v51,125
  Bottom 0.406: J301.6 60.79,143.21 v61,143 | R804.1 48,122 v51,125
!FLT_B2
  Bottom 0.406: R905.1 174.1,56.9 179.2,51.8 J302.6
!FLT_T1
  Bottom 0.406: R801.1 51,129.9 51,144.46 J301.16
!FLT_T2
  Bottom 0.406: R901.1 175,75 177,73 177,61 189.2,48.8 J302.16
+3V3  (via drill 0.3)
  Top 0.61: C1121.1 v103,20 103.83,19.17 arc-45 103.9,19 IC1103.8 | IC1104.8 103.9,10.99 arc45 103.83,11.17 v103,12 C1122.1 | IC303.14 125.69,28.69 v125,28 | C1321.1 v227,20 228,20 228.9,19.1 IC1303.8 | C1322.1 v227,12 228,12 228.9,11.1 IC1304.8 | v49,213 R414.2 50.2,216.09 IC402.8 | R413.2 v61,213 | v73,220 74.91,220 IC403.1 75,219.91 75,220.5 75.9,221.4 C404.1 | IC403.14 IC403.13 82.21,218.54 v82.25,218.5 | IC606.13 IC606.14 | IC606.14 216,58.91 v216,57.75 | R1339.2 v216,55 | IC606.14 IC606.1 | C610.1 v206,60 | R627.2 v210,67 | C517.1 v35,76 | C518.1 v35,84 36,83 36,82 IC503.8 | IC504.8 36,90 v36,91 35,92 C519.1 | IC505.8 36,98 v36,99 | C510.1 v53,81 | v55.25,91 54.09,91 IC506.14 IC506.13 56.46,89.54 57,89 57,88.1 R1139.2 | IC506.1 47.91,91 v46.75,91 46.1,91 R527.2 | IC801.14 58.06,123.81 v58.25,124 | C305.1 v56,155 | IC305.14 46.69,155.94 v47,156.25 | D102.C v136,78 | IC803.14 65.19,131.19 64,130 v63,130 | C812.1 v75,131 | C909.1 185.5,75.5 v186,75 186,73.91 IC901.14 | C910.1 v192,75.5 | IC902.14 190.91,66 v189.75,66 | v191,52.9 191,53.59 IC903.14 | R713.2 v167,92 | C703.1 v162,97 162.9,96.1 IC703.14 | IC703.13 IC703.14 | IC703.1 IC703.14 | R714.2 v174,82 | D101.C v136,117 | C401.1 v53,222 | C304.1 v128,38 | C810.1 v56,114.5 | C811.1 66.5,114.5 v66,115 66,116.09 IC802.14
  VDD 0.61: v82.25,218.5 74.5,218.5 v73,220 | 128,41 v128,38 128,31 v125,28
  Bottom 0.61: v103,12 v103,20 121,20 125,24 v125,28 | v227,12 v227,20 227,29 216,40 v216,41 | v78,114.75 78,116 R818.2 R819.2 R820.2 R821.2 78,122 v78,123.25 | C911.1 193.9,53.9 192.9,52.9 v191,52.9 | 203,65.9 R918.2 R919.2 R920.2 | R920.2 R921.2 | v162.75,65 R916.2 R914.2 R912.2 R910.2 v162.75,77 | R810.2 39,125.9 39,124 38.9,123.9 R812.2 R814.2 R816.2 v37.75,116 | C208.1 80.1,183.56 DCDC202.3 | v206,70 R920.2 | D201.C v124.5,66
  pour VDD (rank 4): 30,40 216,40 216,86 210,92 209,228 29,228
+3V3A  (via drill 0.3)
  Top 0.61: R407.2 v61,221 | R409.1 v49,222 | C405.1 v67,204 | IC401.8 66.9,203.9 arc-90 v67,204 | IC201.6 25.27,112.64 C206.1 25,111 TP5.TP 23,111 23,156 27,160 35,160 43,168 43,192 45,194 v54,194 | R411.1 69.9,204 v67,204
  VDD 0.61: v67,204 67,217 64,220 61,220 | v49,222 51,220 61,220 | v61,221 R407.2 61,220
  Bottom 0.61: v67,204 61,198 61,196 59,194 v54,194
+3V3A_I1  (via drill 0.3)
  Top 0.61: IC203.6 28.64,58.27 C212.1 28,59.1 TP9.TP | R505.2 v24,82 | R502.2 v5,83.25 | v3,115.25 R508.2
  Route3 0.61: v24,82 24,66 TP9.TP
  Route4 0.61: v24,82 23,83 v5,83.25 3,85.25 v3,115.25
  Bottom 0.61: R517.2 v24,82 R505.2
+3V3A_I2  (via drill 0.3)
  Top 0.61: R602.2 v236,107 | R608.2 v236,75 | IC202.6 231.63,41.73 C211.1 232,42.1 TP8.TP | R617.2 v212,108
  Route4 0.61: v212,108 212,107 214,105 236,105 | TP8.TP 236,49 v236,75 236,105 | 236,105 v236,107
  Bottom 0.61: R617.2 v212,108 R619.2
+5V  (via drill 0.3)
  Top 0.61: v61,34 L1001.1 | L1002.1 v30,27 | R1304.2 R1307.2 v183,18 | R1311.2 v193,10 | v212,6.75 212,7.9 R1309.2 212.1,9.8 R1305.2 | L601.1 v223,39 | C617.1 v203,116 | v202,109 202,110 IC603.8 | IC604.8 214,106 v214,106.75 | C618.1 v214,100 214,98 arc-90 IC605.8 | C619.1 v213,92 | C301.1 v58,130 | IC301.16 arc-90 58.95,141.5 58.5,141.5 57.75,142.25 v57.75,142.5 | C303.1 v187,60 187,57.55 IC304.16 | X401.5 31.09,198.91 v31,199 | L1202.1 v147,36 | L1201.1 153,30.6 v153,32 | R704.1 191.1,104 v192.25,104 | IC701.2 IC701.3 184.17,100 v186,100 | IC701.16 178,97.48 v178,96 | v178,96 177.1,95.1 R703.1 | C707.1 179,95 v178,96 | IC701.11 IC701.10 176.18,105.17 v176,105 | C706.1 v182,84 | IC702.8 184.16,89.91 v184.25,90 | R709.1 v190,83 | v36.25,113 36.15,112.9 C203.1 34.73,112.64 IC201.3 IC201.2 | L501.1 v36,123 | R1306.2 v183.9,8.1 | C302.1 116.5,39.5 v117,40 117.9,39.1 IC302.16
  VDD 0.61: v30,27 30,32 37,39 59,39 61,37 v61,34 | 202,116 v202,109 205.25,105.75 213,105.75 v214,106.75 v214,100 213,99 v213,92 213,90 217,86 217,40 218,39 v223,39 | 60,142.5 60,142 58,140 v58,130 43,130 v36,123 36,113.25 v36.25,113 | 60,142.5 60,148 61,149 61,161 | 61,161 142,161 | 142,161 153,161 155,159 155,142 165,132 165,125 175,125 | 185,40 v185,47 185,52 184,53 184,57 v187,60 | 185,40 169,40 168,41 156,41 154,39 | 185,40 186,40 187,39 | v183,18 184,18 186,20 186,22 187,23 | LP101.21 142.03,160.97 142,161 | v203,116 202,116 | 202,116 202,124 201,125 175,125 | 175,125 175,119 172,116 172,105 v176,105 185,105 186,104 | 61,161 61,177 58.46,179.54 DCDC201.3 | v117,40 117,39 | v57.75,142.5 60,142.5 | 186,104 v186,100 186,96 | 186,96 186,93 184.25,91.25 v184.25,90 184.25,87 | v182,84 184.25,86.25 184.25,87 | 186,104 v192.25,104 | v178,96 186,96 | v190,83 190,85 188,87 184.25,87
  Route3 0.61: v183.9,8.1 182,10 | 182,10 182,17 v183,18 | 182,10 v193,10 202,10 204,8 210.75,8 v212,6.75
  Bottom 0.61: v57.75,142.5 55.5,142.5 54.79,143.21 J301.12 | 58,183 54,183 38,199 v31,199 | 58,183 57.9,183.1 C207.1 57.9,189.1 TP6.TP | 58,183 DCDC201.3 | J302.12 185,45.5 v185,47
  pour VDD (rank 3): 59,22 59,40 240,40 240,22
+5V_I1  (via drill 0.3)
  Top 0.61: C501.1 16,75.1 v16,76.5 16,80 16.91,80.91 IC501.8 | C502.1 16,108.1 v16,109.5 16,113 16.91,113.91 IC502.8 | IC203.2 IC203.3 28.64,49.73 C210.1 v27,49 | L501.2 27,123 | 27,123 v24,123 | C509.1 27,123
  pour VDD (rank 3): 1,35 29,35 29,148 1,148
+5V_I2  (via drill 0.3)
  Top 0.61: C601.1 223,114.9 v223,113 223,110 222.09,109.09 IC601.8 | v223,47 L601.2 225.5,45.4 C609.1 | C602.1 223,81.9 v223,80.75 223,77 222.09,76.09 IC602.8 | v230,32 C209.1 231.63,32.73 IC202.3 IC202.2
  VDD 0.61: v223,47 223,46 227,42 227,37 230,34 v230,32
  pour VDD: 240,41 217,41 217,86 212,91 212,145 240,145
+12V  (via drill 0.3)
  Top 0.61: v14,32 12.6,32 L1003.1 | R418.2 91.1,205.1 v93,207 | 93.02,206.99 v93,207 | X201.1 102.98,216.99 v93,207
  VDD 0.61: v14,32 20,32 30,42 30,72 28,74 28,145 v44,161
  Bottom 0.61: v44,161 47,161 69,183 | 69,183 74.46,188.46 | 74.46,188.46 v93,207 | DCDC202.1 74.46,185 | 74.46,185 74.46,188.46 | DCDC201.1 64,183 | 64,183 69,183 | C202.+ 103.2,215.2 95,207 v93,207 | C205.1 74.46,185 | 64,183 64.1,183.1 C204.1 64.1,187.1 TP4.TP | L1203.1 126,12 115,1 20,1 16,5 16,18 12,22 12,30 v14,32 | R419.2 91,209 v93,207
+12V_IGBT  (via drill 0.3)
  Top 0.61: v159,140 150,149 150,157 146,161 134,161 122,173 122,213 119.28,215.72 X201.2 107.47,215.72 v105.5,213.75
  VDD 0.61: U1404.1 U1403.1 U1402.1 U1401.1 31,74 30,75 30,145 53,168 53,190 56,193 62,193 66,197 85,197 101.75,213.75 v105.5,213.75
  Bottom 0.61: C1401.1 41.9,74.1 U1401.1 | U1404.1 70.9,74 C1402.1 | C1404.1 201.9,120 U1405.1 U1406.1 U1407.1 U1408.1 171,120 C1403.1 170.9,120 163,120 159,124 v159,140
ADCIN15
  Top 0.406: C114.1 139.41,84.69 LP101.63
  Bottom 0.406: LP101.63 139.41,84.69 C114.1
ADCINA0
  Top 0.406: R101.1 139.51,130.41 LP101.30
  Bottom 0.406: R101.1 139.51,130.41 LP101.30
ADCINA1
  Top 0.406: R105.1 139.19,66.91 LP101.70
  Bottom 0.406: LP101.70 139.19,66.91 R105.1
ADCINA3
  Top 0.406: R103.1 139.67,140.57 LP101.26
  Bottom 0.406: LP101.26 139.67,140.57 R103.1
ADCINB2
  Top 0.406: LP101.28 139.61,135.49 R102.1
  Bottom 0.406: LP101.28 139.61,135.49 R102.1
ADCINB3
  Top 0.406: R110.1 139.21,143.11 LP101.25
  Bottom 0.406: LP101.25 139.21,143.11 R110.1
ADCINB4
  Top 0.406: C106.1 LP101.68
  Bottom 0.406: LP101.68 C106.1
ADCINB5
  Top 0.406: LP101.65 139.49,79.61 C112.1 D102.A
  Bottom 0.406: LP101.65 139.49,79.61 C112.1
ADCINC2
  Top 0.406: R109.1 139.13,138.03 LP101.27
  Bottom 0.406: LP101.27 139.13,138.03 R109.1
ADCINC3
  Top 0.406: R104.1 139.75,145.65 LP101.24
  Bottom 0.406: LP101.24 139.75,145.65 R104.1
ADCIND0
  Top 0.406: C101.1 139.17,126.93 LP101.91
  Bottom 0.406: LP101.91 139.17,126.93 C101.1
ADCIND1
  Top 0.406: C104.1 139.71,124.39 LP101.92
  Bottom 0.406: LP101.92 139.71,124.39 C104.1
ADCIND2
  Top 0.406: C107.1 139.25,121.85 LP101.93
  Bottom 0.406: LP101.93 139.25,121.85 C107.1
ADCIND3
  Top 0.406: LP101.94 139.41,119.31 C110.1 D101.A
  Bottom 0.406: LP101.94 139.41,119.31 C110.1
CANH  (via drill 0.3)
  Top 0.406: X201.6 117.36,210.63 v118,210
  Route3 0.406: LP101.CANGND 144.57,57.43 143,59 135,59 118,76 v118,210
CANL  (via drill 0.3)
  Top 0.406: X201.7 115.64,209.37 v117,208
  Route3 0.406: LP101.CANH 133.25,56.75 131,59 131,61 117,75 v117,208
CLK_RLS1  (via drill 0.3)
  Top 0.406: v116,31 117.17,29.82 IC302.10
  Route3 0.406: LP101.7 146.97,138.03 147,138 148,138 149,137 v149,31
  Route4 0.406: v149,31 v116,31
CLK_RLS1_5V  (via drill 0.3)
  Top 0.406: IC1001.8 48.53,28.43 arc45 48.36,28.36 47,27 v47,25 | IC302.9 116.56,28.55 v116,28
  Route4 0.406: v47,25 112.89,25 arc45 113.07,25.07 v116,28
CLK_RLS2  (via drill 0.3)
  Top 0.406: IC302.14 122.09,34.91 v123,34
  Route3 0.406: LP101.47 147.47,74.53 148,74 v148,38
  Route4 0.406: v148,38 144,34 v123,34
CLK_RLS2_5V  (via drill 0.3)
  Top 0.406: IC1201.8 176.35,28.6 v175.75,28 | v121,29 121,33 120.36,33.63 IC302.13
  Route4 0.406: v175.75,28 154,28 153,29 v121,29
CLK_SOFT  (via drill 0.3)
  Route3 0.406: v92,135.5 v92,198.54
  Route4 0.406: LP101.13 94.01,135.49 94,135.5 v92,135.5 | X101.8 v92,198.54
CS_RLS1  (via drill 0.3)
  Top 0.406: IC302.6 v103,31.09
  Route3 0.406: LP101.19 95.73,150.73 95,150 95,32 95.91,31.09 v103,31.09
CS_RLS1_5V
  Top 0.406: IC1001.2 IC1001.3 104.61,24.43 110,29.82 IC302.7
CS_RLS2  (via drill 0.3)
  Top 0.406: LP101.59 98.62,87 v94,87 | v119.25,32 118.89,32.37 IC302.12
  Route3 0.406: v94,87 v94,32
  Route4 0.406: v94,32 v119.25,32
CS_RLS2_5V  (via drill 0.3)
  Top 0.406: v175,24 175.6,24.6 IC1201.3 IC1201.2 | IC302.11 118,31 119,31 120,30 v120,29
  Route3 0.406: v120,24 v120,29
  Route4 0.406: v175,24 v120,24
CS_SOFT  (via drill 0.3)
  Route3 0.406: v91,133 v91,201
  Route4 0.406: LP101.12 91,132.95 v91,133 | X101.9 126.35,203 93,203 v91,201
DAC1  (via drill 0.3)
  Top 0.406: R116.2 v36,178
  Route3 0.406: v113,178 v113,133
  Route4 0.406: v36,178 v113,178 | v113,133 112.95,132.95 LP101.32
DAC2  (via drill 0.3)
  Top 0.406: R117.2 v36,166
  Route3 0.406: v112,166 v112,131
  Route4 0.406: v36,166 v112,166 | v112,131 111.41,130.41 LP101.31
DISCH  (via drill 0.3)
  Top 0.406: v31,193 32.23,193 X401.1 | v102,195 102,201 106.56,205.56 X201.10 120.44,205.56 v121,205
  Route3 0.406: v121,205 v121,77
  Route4 0.406: v102,195 42,195 40,193 v31,193
  Bottom 0.406: v121,77 121,73.9 R201.2
DISCH_MEAS
  Bottom 0.406: C201.1 R202.2 | R202.2 D201.A R201.1 | LP101.50 141.66,64 132,64 130.9,65.1 R202.2
ERR_EICE1
  Top 0.305: 55.2,123.2 63,123.2
  Top 0.406: IC801.6 52.46,117.46 53,118 53,121 55.2,123.2 | IC802.9 63.66,122.54 63,123.2
ERR_EICE2  (via drill 0.3)
  Top 0.406: IC901.6 182.46,67.46 v183,68 | IC902.9 188.54,72.54 v188,72
  Route4 0.406: v183,68 184,68 v188,72
ERR_I1  (via drill 0.3)
  Top 0.406: v46.75,84.25 46.96,84.46 IC506.6
  Route3 0.406: v60,115 64,119 64,137 68,141 v68,157
  Route4 0.406: v68,157 133,157 138,152 143,152 144.27,150.73 LP101.2
  Bottom 0.406: R803.1 61,116 v60,115 46,101 46,85 v46.75,84.25
ERR_I1A  (via drill 0.3)
  Top 0.406: IC802.10 62.27,121.27 v61,120
  Bottom 0.406: R803.2 v61,120
ERR_I2  (via drill 0.3)
  Top 0.406: IC606.6 209.46,65.79 v209,66.25 | v197,64 R903.1
  Route4 0.406: v209,66.25 206.25,66.25 204,64 v197,64
ERR_I2A  (via drill 0.3)
  Top 0.406: R903.2 193.9,67.1 192.27,68.73 IC902.12 190.83,69 v188,69
  Route3 0.406: v188,69 187,70 187,84.75 v186.77,84.98
  Route4 0.406: v186.77,84.98 184.5,87.25 144.59,87.25 LP101.42
ERR_OV  (via drill 0.3)
  Top 0.406: IC403.8 81.81,212.19 v82.5,211.5 | v83,118 R808.1 | v206,68 R908.1
  Route3 0.406: v82.5,211.5 85,209 85,148 83,146 v83,118 83,116 80,113 v80,72
  Route4 0.406: v206,68 205,67 193,67 190,64 98,64 97,65 97,71.99 | LP101.53 97,71.99 | 97,71.99 v80.01,71.99 v80,72
ERR_RESET  (via drill 0.3)
  Top 0.406: IC606.3 213.27,63.27 v212,62 IC606.11 | IC506.11 52,87 v50.73,88.27 IC506.3 | IC302.2 109.7,36.17 v107.7,38.17 | IC703.11 160.5,91.5 159.23,92.77 IC703.3 156.23,92.77 155,94 155,106 153,108 v144.57,108 | v83,216 IC403.11 79,216 77.73,217.27 IC403.3
  Route3 0.406: v107.7,38.17 v107.7,62 v107.7,108 | v144.57,108 LP101.10 | v51,108 51,88.54 v50.73,88.27 | v84,108 84,145 86,147 86,213 v83,216
  Route4 0.406: v144.57,108 v107.7,108 v84,108 v51,108 | v212,62 v107.7,62
ERR_RESET_5V  (via drill 0.3)
  Top 0.406: R1001.1 v34,26 | IC302.3 v110,34.91 | v161,25 R1201.1 161.9,28.9 v162,29
  Route3 0.406: v110,34.91 v110,26 v110,24 | v162,29 174,29 v176,31 | v86,26 86,42 79,49 79,128 75,132 75,150 v70,155
  Route4 0.406: v34,26 v86,26 v110,26 | v161,25 115,25 114,24 v110,24 | v63,155 v70,155
  Bottom 0.406: R307.2 v63,155 | R314.2 176,34.9 v176,31
ERR_RESET_RLS1
  Top 0.406: IC1001.33 38.38,22.83 arc-45 38.2,22.9 C1001.1 R1001.2
ERR_RESET_RLS2
  Top 0.406: IC1201.33 C1201.1 R1201.2
ERR_T1_UNLATCHED  (via drill 0.3)
  Top 0.406: R1140.1 R1139.1 59.1,86.1 59,86 67,86 77,76 77,51 88,40 v88,31
  Bottom 0.406: R1138.2 101,21.1 | 101,21.1 R1136.2 100,22.1 100,24 93,31 v88,31 | R1137.2 101,21.1
ERR_T2_UNLATCHED  (via drill 0.3)
  Top 0.406: R1340.1 211.1,55 R1339.1 212.9,51.1 218,46 218,37 224,31 v224,25
  Bottom 0.406: R1338.2 225,22.1 | 225,22.1 R1336.2 224.1,24.9 v224,25 | 225,22.1 R1337.2
ERR_T_MIPAQ1  (via drill 0.3)
  Top 0.406: IC703.6 155.04,88.96 154,90 v154,105 | R809.1 85,122 v86,121
  Route3 0.406: v86,105 v86,121
  Route4 0.406: v154,105 v86,105
ERR_T_MIPAQ2  (via drill 0.3)
  Top 0.406: IC703.8 162.9,84.1 v166,81 | v203,78 203,72.1 R909.1
  Route4 0.406: v166,81 200,81 v203,78
ERR_T_MOTOR1  (via drill 0.3)
  Top 0.406: IC506.8 53.9,82.1 55,81 v69,81 | v77,120 R807.1
  Route3 0.406: v69,81 77,89 v77,120
ERR_T_MOTOR2
  Top 0.406: IC606.8 208.09,59 205,59 203.1,60.9 R906.1
ERR_UDC_TEMP1  (via drill 0.3)
  Top 0.406: IC802.12 67.73,118.73 69,120 69,121 70.54,122.54 IC802.6 74.04,122.54 76.5,125 v76.5,129 | LP101.5 143.46,142 141,142 140.5,141.5 v135,141.5
  Route4 0.406: v135,141.5 130,136.5 130,130 129,129 v76.5,129
ERR_UDC_TEMP2  (via drill 0.3)
  Top 0.406: IC902.10 193.27,71.27 v194,72 194.54,72.54 IC902.6
  Route3 0.406: v194,78 v194,72
  Route4 0.406: v194,78 192.39,79.61 LP101.45
ERR_UV  (via drill 0.3)
  Top 0.406: IC403.6 76.54,213.46 v77,213 | v80,116 R806.1 | v188,82 201,82 205,78 205,71 204,70 R907.1
  Route3 0.406: v80,116 80,129 76,133 76,155 84,163 84,206 v77,213 | LP101.9 v146,132.95 v146,109 | v163,129 163,122 171,114 186,114 188,112 v188,82
  Route4 0.406: v146,132.95 159.05,132.95 v163,129 | v80,116 80,111 82,109 v146,109
GND  (via drill 0.3)
  Top 0.254: 30.2,78 IC503.4